# Altium project ek-ra8d2_mp - Customer.PrjPcb (part 4 of 5)

## Sheet USB High Speed.SchDoc
size A3; Company Name: Renesas Electronics America; CompanyURL: www.renesas.com; PageSetup: Record=PageOptions|CenterHorizontal=True|CenterVertical=True|PrintScale=1.00|XCorrection=1.00|YCorrection=1.00|PrintKind=1|BorderSize=5000000|LeftOffset=0|BottomOffset=0|Orientation=2|PaperLength=1000|PaperWidth=1000|Scale=100|PaperSource=7|PrintQuality=-4|MediaType=1|DitherType=10|PaperKind=A5 148x210mm|PrintScaleMode=1; ReleaseDate: 16.09.2025; Version: MP; SPICEModelCache: <root> / <DocumentId>LYYELOHJ</DocumentId> / </root>; SheetNumber: 14; SheetTotal: 18; VariantNumber: 0; DSheetNumber: 1
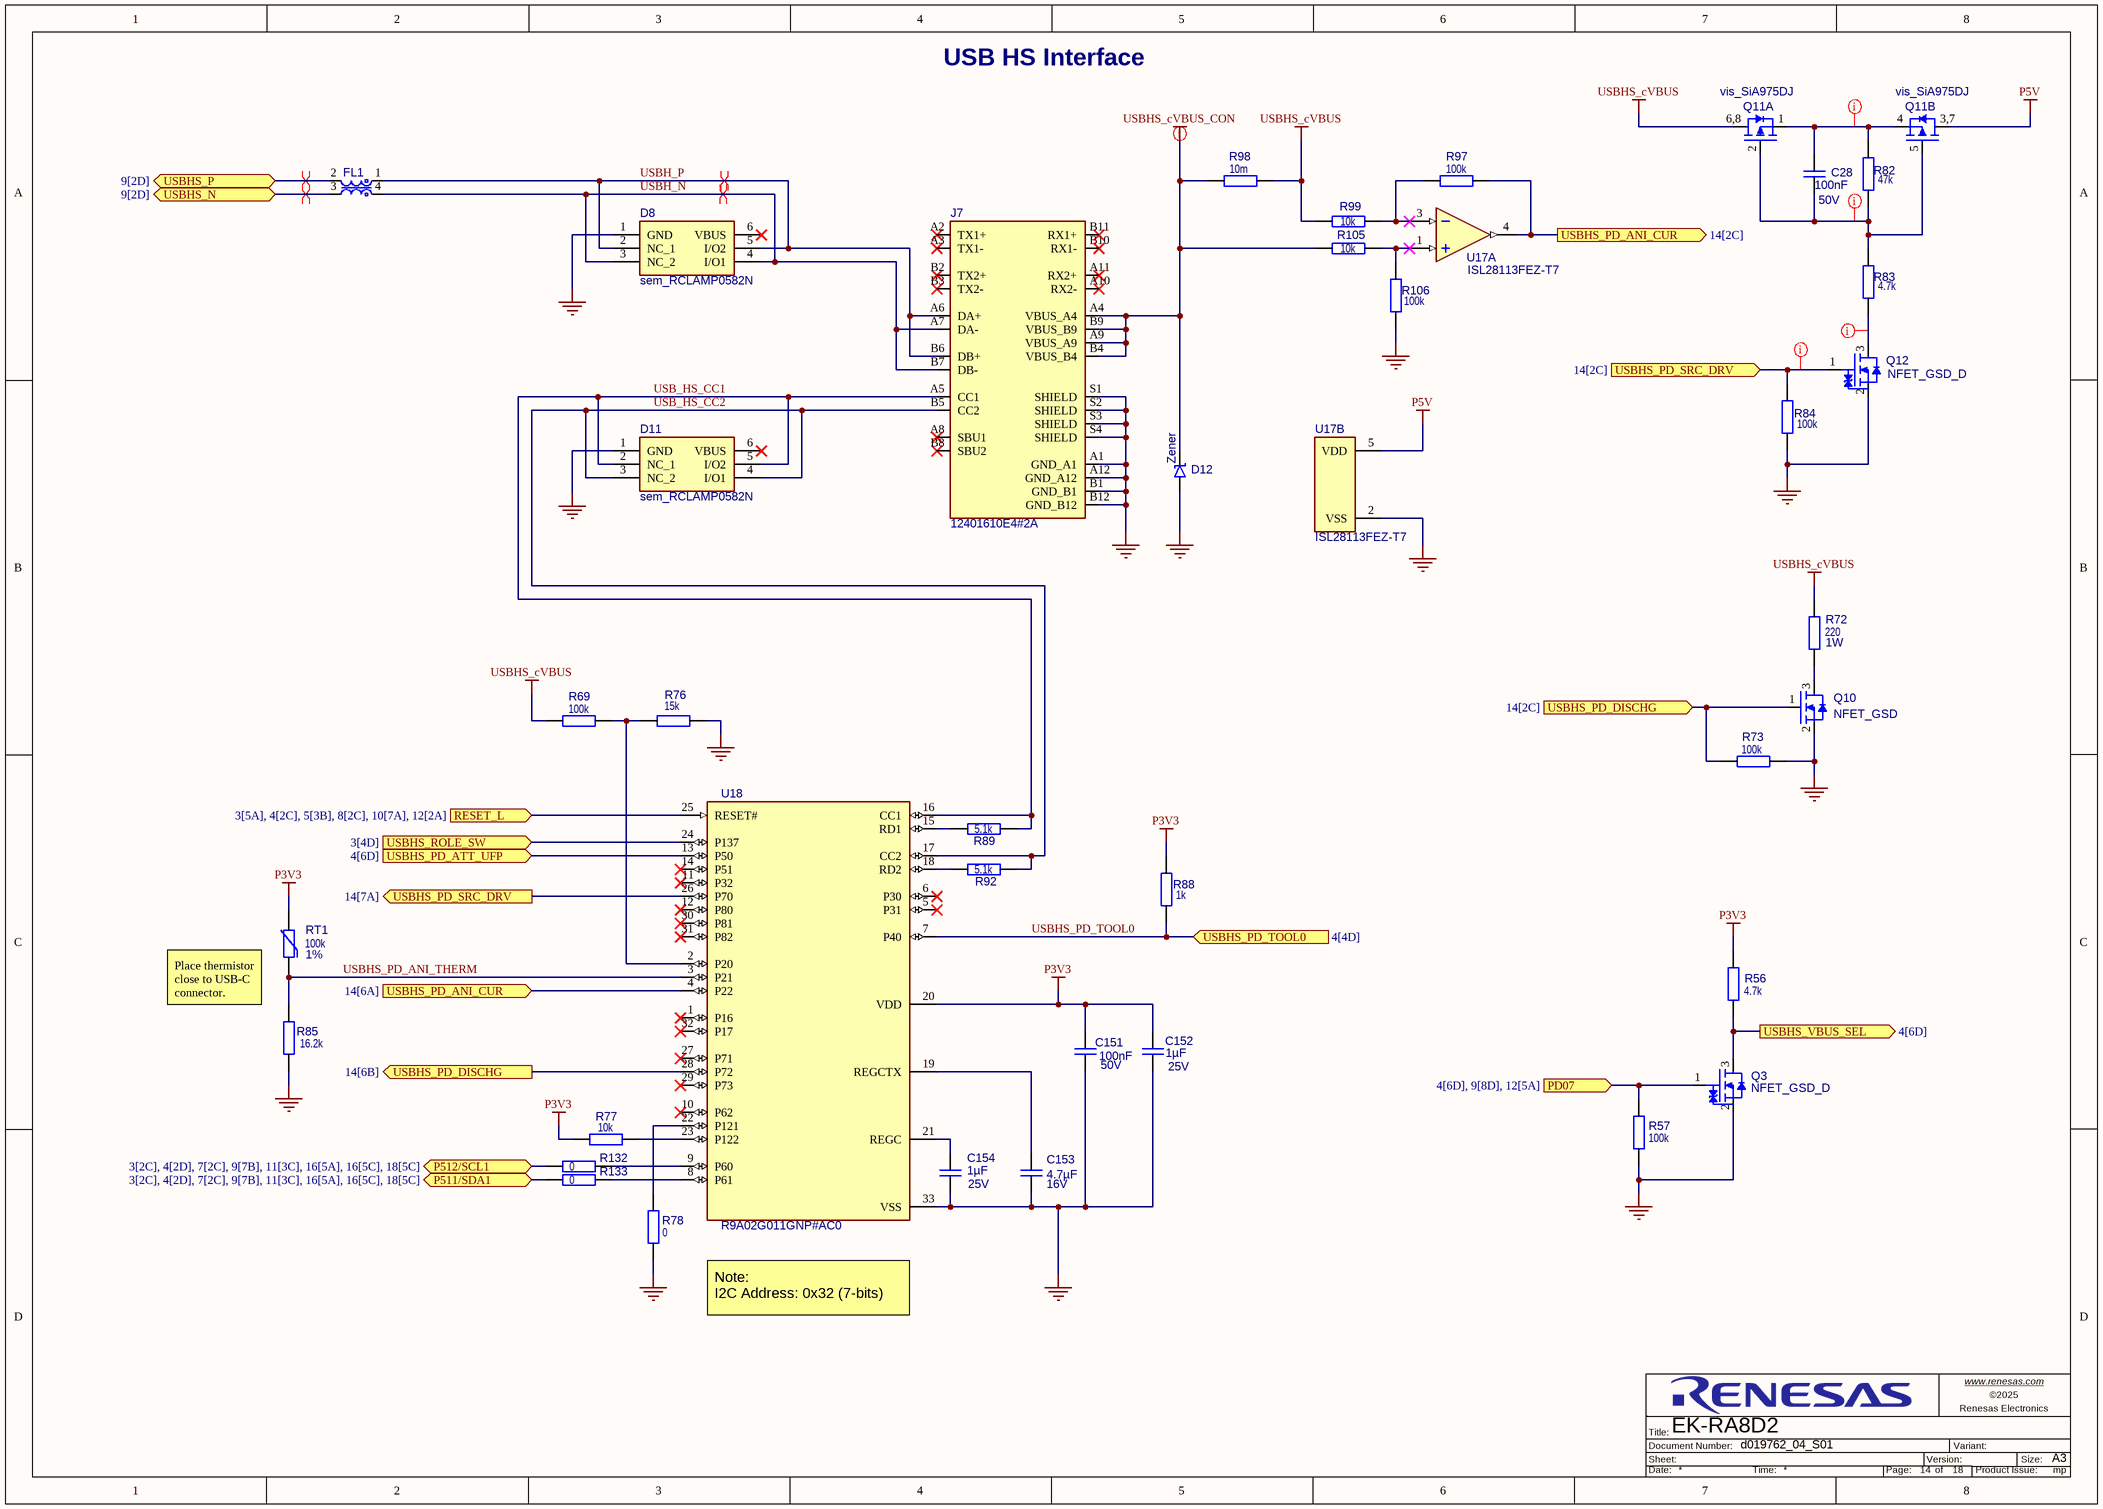
[diagram p13: USB High Speed.SchDoc]

### Parts
C28  value 100nF  Operating Voltage Max: 50V  [C_EIA0402_0p55]  (hidden comment: Capacitor)
C151  value 100nF  Operating Voltage Max: 50V  [C_EIA0402_0p55]  (hidden comment: Capacitor)
C152  value 1µF  Operating Voltage Max: 25V  [C_EIA0402_0p6]  (hidden comment: Capacitor)
C153  value 4.7µF  Operating Voltage Max: 16V  [C_EIA0603_1p0]  (hidden comment: Capacitor)
C154  value 1µF  Operating Voltage Max: 25V  [C_EIA0402_0p6]  (hidden comment: Capacitor)
D8  sem_RCLAMP0582N  [sem_SLP-6_SLP1210N6]
D11  sem_RCLAMP0582N  [sem_SLP-6_SLP1210N6]
D12  Zener  [sem_SGP-2_SGP1610N2]
FL1  CMC_1-2_4-3  [mur_EIA03025]  (value not drawn)
J7  12401610E4#2A  [amp_12401610E42A]
Q3  NFET_GSD_D  [roh_SOT-416FL_SC-89]
Q10  NFET_GSD  [ir_sot-23_3N]
Q11  vis_SiA975DJ  [vis_SC70-6L_Dual]  (parts A,B of 2)
Q12  NFET_GSD_D  [roh_SOT-416FL_SC-89]
R56  value 4.7k  [R_EIA0402]  (hidden comment: Resistor)
R57  value 100k  [R_EIA0402]  (hidden comment: Resistor)
R69  value 100k  [R_EIA0402]  (hidden comment: Resistor)
R72  value 220  Power: 1W  [R_EIA2512]  (hidden comment: Resistor)
R73  value 100k  [R_EIA0402]  (hidden comment: Resistor)
R76  value 15k  [R_EIA0402]  (hidden comment: RC0402FR-0715KL)
R77  value 10k  [R_EIA0402]  (hidden comment: Resistor)
R78  value 0  [R_EIA0402]  (hidden comment: Resistor)
R82  value 47k  [R_EIA0402]  (hidden comment: Resistor)
R83  value 4.7k  [R_EIA0402]  (hidden comment: Resistor)
R84  value 100k  [R_EIA0402]  (hidden comment: Resistor)
R85  value 16.2k  [R_EIA0402]  (hidden comment: Resistor)
R88  value 1k  [R_EIA0402]  (hidden comment: Resistor)
R89  value 5.1k  [R_EIA0402]  (hidden comment: Resistor)
R92  value 5.1k  [R_EIA0402]  (hidden comment: Resistor)
R97  value 100k  [R_EIA0402]  (hidden comment: Resistor)
R98  value 10m  [R_EIA0603]  (hidden comment: Resistor)
R99  value 10k  [R_EIA0402]  (hidden comment: Resistor)
R105  value 10k  [R_EIA0402]  (hidden comment: Resistor)
R106  value 100k  [R_EIA0402]  (hidden comment: Resistor)
R132  value 0  [R_EIA0402]  (hidden comment: Resistor)
R133  value 0  [R_EIA0402]  (hidden comment: Resistor)
RT1  value 100k  Tolerance: 1%  [R_EIA0402]  (hidden comment: Thermistor)
U17  ISL28113FEZ-T7  [ren_SC70-5_P5.049]  (parts A,B of 2)
U18  R9A02G011GNP#AC0  [ren_HVQFN-32_PVQN0032KG-A]

### Ports
P511/SDA1 (bidir, see 3[2C], 4[2D], 7[2C], 9[7B], 11[3C], 16[5A], 16[5C], 18[5C]), P512/SCL1 (bidir, see 3[2C], 4[2D], 7[2C], 9[7B], 11[3C], 16[5A], 16[5C], 18[5C]), PD07 (in, see 4[6D], 9[8D], 12[5A]), RESET_L (in, see 3[5A], 4[2C], 5[3B], 8[2C], 10[7A], 12[2A]), USBHS_N (bidir, see 9[2D]), USBHS_P (bidir, see 9[2D]), USBHS_PD_ANI_CUR (in, see 14[6A]), USBHS_PD_ANI_CUR (out, see 14[2C]), USBHS_PD_ATT_UFP (in, see 4[6D]), USBHS_PD_DISCHG (in, see 14[2C]), USBHS_PD_DISCHG (out, see 14[6B]), USBHS_PD_SRC_DRV (in, see 14[2C]), USBHS_PD_SRC_DRV (out, see 14[7A]), USBHS_PD_TOOL0 (in, see 4[4D]), USBHS_ROLE_SW (in, see 3[4D]), USBHS_VBUS_SEL (out, see 4[6D])

### Nets
GND: C151.2 C152.1 C153.2 C154.1 D8.1(GND) D11.1(GND) D12.2(A) J7.A1(GND_A1) J7.A12(GND_A12) J7.B1(GND_B1) J7.B12(GND_B12) J7.S1(SHIELD) J7.S2(SHIELD) J7.S3(SHIELD) J7.S4(SHIELD) Q3.2(Source) Q10.2(Source) Q12.2(Source) R57.1 R73.2 R76.1 R78.1 R84.1 R85.1 R106.1 U17.2(VSS) U18.33(VSS)
P3V3: C151.1 C152.2 R56.2 R77.2 R88.2 RT1.2 U18.20(VDD)
P5V: Q11.3,7(Drain2) U17.5(VDD)
USBHS_cVBUS: Q11.6,8(Drain1) R69.1 R72.2 R98.2 R99.1
USBHS_cVBUS_CON: D12.1(K) J7.A4(VBUS_A4) J7.A9(VBUS_A9) J7.B4(VBUS_B4) J7.B9(VBUS_B9) R98.1 R105.1
P511/SDA1: R133.2 ; port P511/SDA1
P512/SCL1: R132.2 ; port P512/SCL1
PD07: Q3.1(Gate) R57.2 ; port PD07
RESET_L: U18.25(RESET#) ; port RESET_L
USB_HS_CC1: D11.2(NC_1) D11.5(I/O2) J7.A5(CC1) R89.2 U18.16(CC1)
USB_HS_CC2: D11.3(NC_2) D11.4(I/O1) J7.B5(CC2) R92.2 U18.17(CC2)
USBH_N: D8.3(NC_2) D8.4(I/O1) FL1.4 J7.A7(DA-) J7.B7(DB-)
USBH_P: D8.2(NC_1) D8.5(I/O2) FL1.1 J7.A6(DA+) J7.B6(DB+)
USBHS_N: FL1.3 ; port USBHS_N
USBHS_P: FL1.2 ; port USBHS_P
USBHS_PD_ANI_CUR: R97.2 U17.4(OUT) U18.4(P22) ; port USBHS_PD_ANI_CUR
USBHS_PD_ANI_THERM: R85.2 RT1.1 U18.3(P21)
USBHS_PD_ATT_UFP: U18.13(P50) ; port USBHS_PD_ATT_UFP
USBHS_PD_DISCHG: Q10.1(Gate) R73.1 U18.28(P72) ; port USBHS_PD_DISCHG
USBHS_PD_SRC_DRV: Q12.1(Gate) R84.2 U18.26(P70) ; port USBHS_PD_SRC_DRV
USBHS_PD_TOOL0: R88.1 U18.7(P40) ; port USBHS_PD_TOOL0
USBHS_ROLE_SW: U18.24(P137) ; port USBHS_ROLE_SW
USBHS_VBUS_SEL: Q3.3(Drain) R56.1 ; port USBHS_VBUS_SEL
NetC28_1: C28.1 Q11.2(Gate1) Q11.5(Gate2) R82.1 R83.2
NetC28_2: C28.2 Q11.1(Source1) Q11.4(Source2) R82.2
NetC153_1: C153.1 U18.19(REGCTX)
NetC154_2: C154.2 U18.21(REGC)
NetQ10_3: Q10.3(Drain) R72.1
NetQ12_3: Q12.3(Drain) R83.1
NetR69_2: R69.2 R76.2 U18.2(P20)
NetR77_1: R77.1 U18.23(P122)
NetR78_2: R78.2 U18.22(P121)
NetR89_1: R89.1 U18.15(RD1)
NetR92_1: R92.1 U18.18(RD2)
NetR97_1: R97.1 R99.2 U17.3(IN-)
NetR105_2: R105.2 R106.2 U17.1(IN+)
NetR132_1: R132.1 U18.9(P60)
NetR133_1: R133.1 U18.8(P61)

Not connected (* = marked no-connect by the designer): D8 6(VBUS)*; D11 6(VBUS)*; J7 A2(TX1+)* A3(TX1-)* A8(SBU1)* A10(RX2-)* A11(RX2+)* B2(TX2+)* B3(TX2-)* B8(SBU2)* B10(RX1-)* B11(RX1+)*; U18 1(P16)* 5(P31)* 6(P30)* 10(P62)* 11(P32)* 12(P80)* 14(P51)* 27(P71)* 29(P73)* 30(P81)* 31(P82)* 32(P17)*

### Layout directives
differential pair; differential pair class USB: USBH_N, USBH_P, USBHS_N, USBHS_P
net class Power: NetC28_2
net class Power_Control: NetC28_1, NetQ12_3, USBHS_PD_SRC_DRV
net class Power; rule Supply Nets [Voltage = 5.000]: USBHS_cVBUS_CON

### Notes on the sheet
- USB HS Interface
- Place thermistor close to USB-C connector.
- Note:
  I2C Address: 0x32 (7-bits)
- www.renesas.com <http://www.renesas.com>
- Sheet:
- Title:
- Document Number:
- Version:
- Variant:
- Renesas Electronics
- Size:
- A3
- Date:
- Time:
- Page:
- of
- Product Issue:

### Library data of the parts
C28 C151 = CAP-00003203-9: as C108 on sheet Gigabit Ethernet; Dielectric: X7R; Height: 550µm; Operating Temperature Max: 125°C; Operating Temperature Min: -55°C
C152 C154 = CAP-00000014-5: Capacitor,EIA0402,1u,25V,X6S; Tolerance: 10%; Qualification: AEC-Q200; Subtype: MLCC; Dielectric: X6S; Height: 600µm; Operating Temperature Max: 105°C; Operating Temperature Min: -55°C
C153 = CAP-00003210-8: Capacitor,EIA0603,4.7u,16V,X7S; Tolerance: 10%; Qualification: AEC-Q200; Subtype: MLCC; Dielectric: X7S; Height: 1mm; Operating Temperature Max: 125°C; Operating Temperature Min: -55°C
D8 D11 = DIO-00003463-14: Low Capacitance TVS Diode Array; Qualification: AEC-Q100; Reverse Voltage: 6.5V; Subtype: ESD; Height: 580µm; Operating Temperature Max: 125°C; Operating Temperature Min: -40°C
D12 = DIO-00000001-5: ESD Suppressor Diode TVS Uni-Dir 22V 55Vc Automotive 2-Pin SGP T/R; Qualification: AEC-Q100; Height: 550µm; Operating Temperature Max: 125°C; Operating Temperature Min: -40°C; Reverse Voltage: 22V; Subtype: ESD
FL1 = IND-00000004-4: Common Mode Choke / Filters, 90uH 25%, 0.1A, 3.8Ohm DCR; Current: 100mA; DC Resistance: 3.8; Frequency: 100MHz; Subtype: CMC; Value: 90; Tolerance: 25%; Height: 450mm; Operating Temperature Max: 85°C; Operating Temperature Min: -40°C; Qualification: -
J7 = CON-00000065-5: Connector USB 3.2 Gen2 Type C Horizontal SMD; Gender: female; Current: 5A; Operating Voltage Max: 20V; Pin Count: 24; Operating Temperature Max: 85°C; Qualification: -; Operating Temperature Min: -40°C; Height: 3.43mm
Q3 Q12 = TRA-00000001-2: N-Channel 60V 250mA Small Signal MOSFET; DC Resistance: 2.4; Gate Voltage Threshold Max: 2.3V; Gate Voltage Threshold Min: 1V; Input Capacitance: 15pF; Power: 150mW; Subtype: NMOS; Current: 250mA; Operating Temperature Max: 150°C; Operating Temperature Min: -55°C; Operating Voltage Max: 60V; Pin Count: 3; Qualification: -
Q10 = TRA-00000004-3: N-Channel 30V 5A 1.3W MOSFET; DC Resistance: 29m; Gate Voltage Threshold Max: 1.1V; Gate Voltage Threshold Min: 500mV; Input Capacitance: 650pF; Subtype: NMOS; Current: 5A; Operating Temperature Max: 150°C; Operating Temperature Min: -55°C; Operating Voltage Max: 30V; Pin Count: 3; Power: 1.3W; Qualification: -
Q11 = TRA-00000003-7: Dual P-Channel -12V -4.5A MOSFET; DC Resistance: 0.11; Gate Voltage Threshold Max: -1V; Gate Voltage Threshold Min: -400mV; Input Capacitance: 1.5nF; Power: 1.9W; Subtype: PMOS; Current: -4.5A; Operating Temperature Max: 150°C; Operating Temperature Min: -55°C; Operating Voltage Max: -12V; Pin Count: 6; Qualification: -
R56 R83 = RES-00000894-9: Resistor,EIA0402,4.7k,0.0625W; Power: 62.5mW; Tolerance: 1%; Subtype: Chip Resistor; Operating Temperature Max: 155°C; Operating Temperature Min: -55°C; Qualification: -
R57 R69 R73 R84 R97 R106 = RES-00000926-9: Resistor,EIA0402,100k,0.0625W; Power: 62.5mW; Tolerance: 1%; Subtype: Chip Resistor; Operating Temperature Max: 155°C; Operating Temperature Min: -55°C; Qualification: -
R72 = RES-00003204-2: Resistor,EIA2512,220,1W; Tolerance: 1%; Operating Voltage Max: 200V; Qualification: AEC-Q100; Subtype: Chip Resistor; Height: 750µm; Operating Temperature Max: 155°C; Operating Temperature Min: -55°C; Temperature Coefficient: -
R76 = RES-00000906-9: Resistor,EIA0402,15k,0.0625W; Tolerance: 1%; Power: 62.5mW; Subtype: Chip Resistor; Operating Temperature Min: -55°C; Qualification: -; Operating Temperature Max: 155°C
R77 R99 R105 = RES-00000902-9: Resistor,EIA0402,10k,0.0625W; Power: 62.5mW; Tolerance: 1%; Subtype: Chip Resistor; Operating Temperature Max: 155°C; Operating Temperature Min: -55°C; Qualification: -
R78 R132 R133 = RES-00000801-9: Resistor,EIA0402,0,0.0625W; Power: 62.5mW; Tolerance: 5%; Subtype: Chip Resistor; Operating Temperature Max: 155°C; Operating Temperature Min: -55°C; Qualification: -
R82 = RES-00000918-9: Resistor,EIA0402,47k,0.0625W; Power: 62.5mW; Tolerance: 1%; Subtype: Chip Resistor; Operating Temperature Max: 155°C; Operating Temperature Min: -55°C; Qualification: -
R85 = RES-00001689-10: Resistor,EIA0402,16.2k,0.0625W; Power: 62.5mW; Tolerance: 1%; Subtype: Chip Resistor; Operating Temperature Max: 155°C; Operating Temperature Min: -55°C; Qualification: -
R88 = RES-00000878-9: Resistor,EIA0402,1k,0.0625W; Power: 62.5mW; Tolerance: 1%; Subtype: Chip Resistor; Operating Temperature Max: 155°C; Operating Temperature Min: -55°C; Qualification: -
R89 R92 = RES-00000895-9: Resistor,EIA0402,5.1k,0.0625W; Power: 62.5mW; Tolerance: 1%; Subtype: Chip Resistor; Operating Temperature Max: 155°C; Operating Temperature Min: -55°C; Qualification: -
R98 = RES-00003205-3: Resistor,EIA0603,10m,0.25W; Power: 250mW; Tolerance: 1%; Qualification: AEC-Q200; Subtype: Chip Resistor; Height: 700µm; Operating Temperature Max: 125°C; Operating Temperature Min: -55°C
RT1 = RES-00000000-6: NTC Thermistor, R_EIA0402, 100K, 4250K; Operating Voltage Max: 5V; Power: 160µW; Height: 550µm; Operating Temperature Max: 125°C; Operating Temperature Min: -40°C; Qualification: -; Subtype: Thermistor
U17 = ICS-00000015-3: Single, General Purpose Micropower, RRIO Operational Amplifier; Frequency: 2MHz; Operating Voltage Max: 5.5V; Operating Voltage Min: 1.8V; Subtype: Power; Operating Temperature Max: 125°C; Operating Temperature Min: -40°C; Output Voltage Max: 5.5V; Pin Count: 5; Qualification: -
U18 = ICS-00000018-7: USB Power Delivery Controller, USB 3.1, HVQFN32; Frequency: 24MHz; Operating Voltage Max: 5.5V; Operating Voltage Min: 3V; Output Voltage Min: 0V; Subtype: Digital; Operating Temperature Max: 105°C; Operating Temperature Min: -40°C; Output Voltage Max: 5.5V; Pin Count: 33; Qualification: -

## Sheet Octal SPI Flash.SchDoc
size A3; Company Name: Renesas Electronics America; CompanyURL: www.renesas.com; PageSetup: Record=PageOptions|CenterHorizontal=True|CenterVertical=True|PrintScale=1.00|XCorrection=1.00|YCorrection=1.00|PrintKind=1|BorderSize=5000000|LeftOffset=0|BottomOffset=0|Orientation=2|PaperLength=1000|PaperWidth=1000|Scale=100|PaperSource=7|PrintQuality=-4|MediaType=1|DitherType=10|PaperKind=A5 148x210mm|PrintScaleMode=1; ReleaseDate: 16.09.2025; Version: MP; SheetNumber: 15; SheetTotal: 18; VariantNumber: 0; DSheetNumber: 1
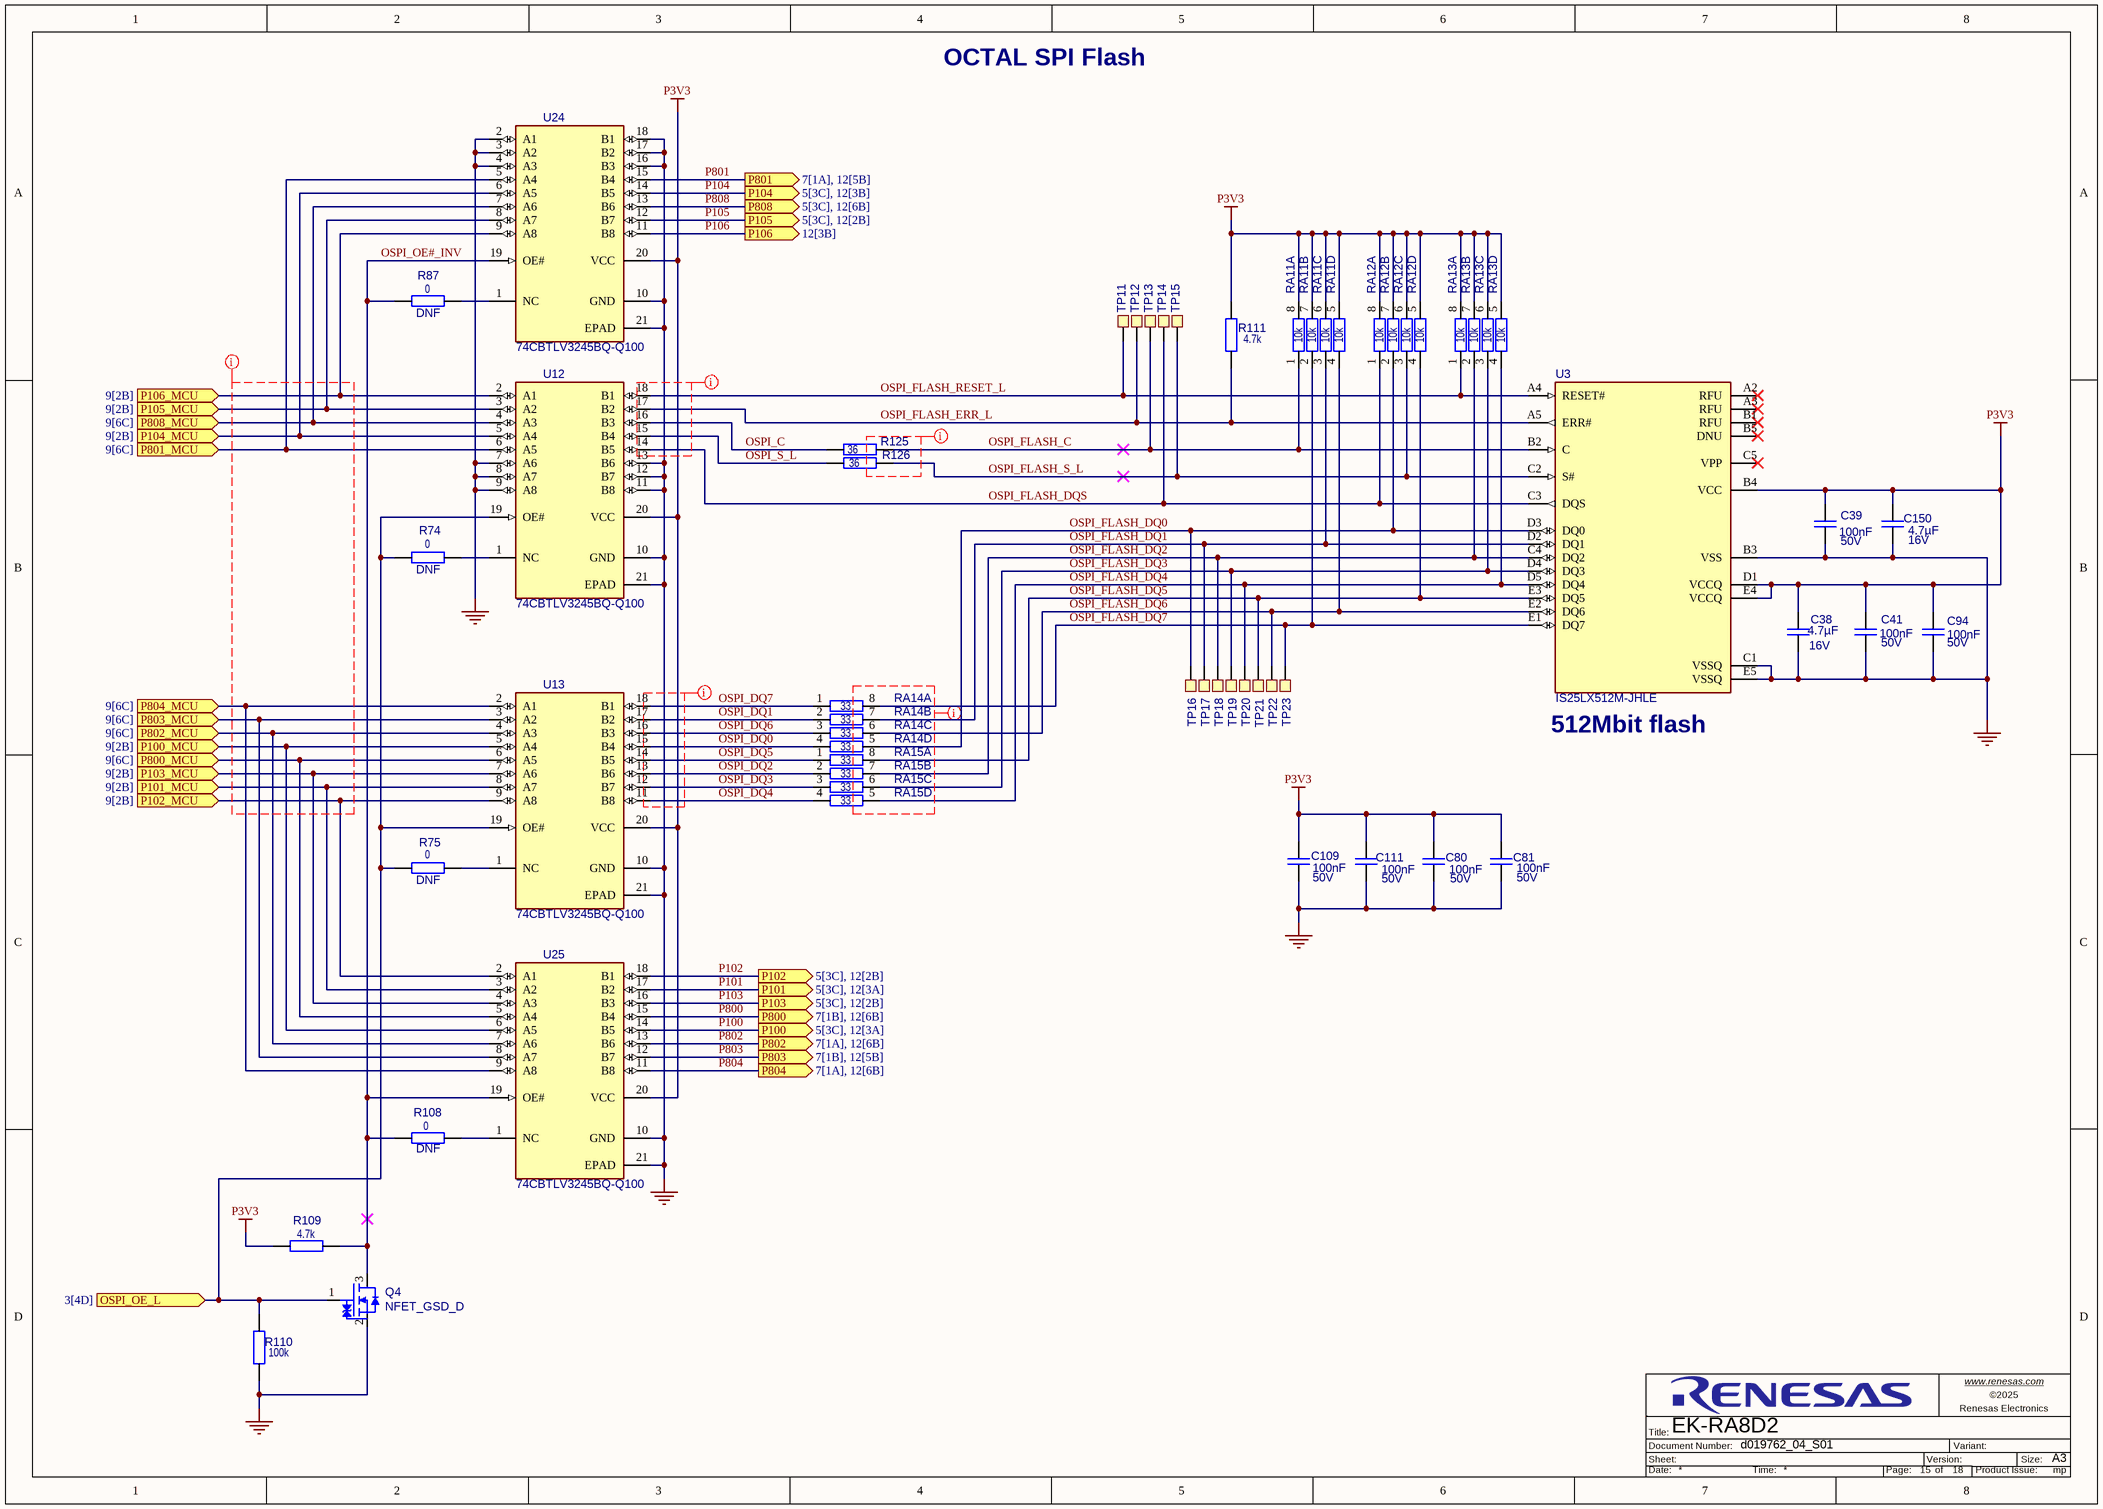
[diagram p14: Octal SPI Flash.SchDoc]

### Parts
C38  value 4.7µF  Operating Voltage Max: 16V  [C_EIA0402_0p7]  (hidden comment: KGM05CR51C475MH)
C39  value 100nF  Operating Voltage Max: 50V  [C_EIA0402_0p55]  (hidden comment: Capacitor)
C41  value 100nF  Operating Voltage Max: 50V  [C_EIA0402_0p55]  (hidden comment: Capacitor)
C80  value 100nF  Operating Voltage Max: 50V  [C_EIA0402_0p55]  (hidden comment: Capacitor)
C81  value 100nF  Operating Voltage Max: 50V  [C_EIA0402_0p55]  (hidden comment: Capacitor)
C94  value 100nF  Operating Voltage Max: 50V  [C_EIA0402_0p55]  (hidden comment: Capacitor)
C109  value 100nF  Operating Voltage Max: 50V  [C_EIA0402_0p55]  (hidden comment: Capacitor)
C111  value 100nF  Operating Voltage Max: 50V  [C_EIA0402_0p55]  (hidden comment: Capacitor)
C150  value 4.7µF  Operating Voltage Max: 16V  [C_EIA0402_0p7]  (hidden comment: KGM05CR51C475MH)
Q4  NFET_GSD_D  [roh_SOT-416FL_SC-89]
R74  value 0  [R_EIA0402]  (hidden comment: Resistor)
R75  value 0  [R_EIA0402]  (hidden comment: Resistor)
R87  value 0  [R_EIA0402]  (hidden comment: Resistor)
R108  value 0  [R_EIA0402]  (hidden comment: Resistor)
R109  value 4.7k  [R_EIA0402]  (hidden comment: Resistor)
R110  value 100k  [R_EIA0402]  (hidden comment: Resistor)
R111  value 4.7k  [R_EIA0402]  (hidden comment: Resistor)
R125  value 36  [R_EIA0402]  (hidden comment: Resistor)
R126  value 36  [R_EIA0402]  (hidden comment: Resistor)
RA11  value 10k  [R_Array_EIA0804]  (hidden comment: Resistor_Array)  (parts A,B,C,D of 4)
RA12  value 10k  [R_Array_EIA0804]  (hidden comment: Resistor_Array)  (parts A,B,C,D of 4)
RA13  value 10k  [R_Array_EIA0804]  (hidden comment: Resistor_Array)  (parts A,B,C,D of 4)
RA14  value 33  [R_Array_EIA0804]  (hidden comment: Resistor_Array)  (parts A,B,C,D of 4)
RA15  value 33  [R_Array_EIA0804]  (hidden comment: Resistor_Array)  (parts A,B,C,D of 4)
TP11  TP_VIA_0p45_0p15  [TP_VIA_0p45_0p15]  (value not drawn)  (no BOM)
TP12  TP_VIA_0p45_0p15  [TP_VIA_0p45_0p15]  (value not drawn)  (no BOM)
TP13  TP_VIA_0p45_0p15  [TP_VIA_0p45_0p15]  (value not drawn)  (no BOM)
TP14  TP_VIA_0p45_0p15  [TP_VIA_0p45_0p15]  (value not drawn)  (no BOM)
TP15  TP_VIA_0p45_0p15  [TP_VIA_0p45_0p15]  (value not drawn)  (no BOM)
TP16  TP_VIA_0p45_0p15  [TP_VIA_0p45_0p15]  (value not drawn)  (no BOM)
TP17  TP_VIA_0p45_0p15  [TP_VIA_0p45_0p15]  (value not drawn)  (no BOM)
TP18  TP_VIA_0p45_0p15  [TP_VIA_0p45_0p15]  (value not drawn)  (no BOM)
TP19  TP_VIA_0p45_0p15  [TP_VIA_0p45_0p15]  (value not drawn)  (no BOM)
TP20  TP_VIA_0p45_0p15  [TP_VIA_0p45_0p15]  (value not drawn)  (no BOM)
TP21  TP_VIA_0p45_0p15  [TP_VIA_0p45_0p15]  (value not drawn)  (no BOM)
TP22  TP_VIA_0p45_0p15  [TP_VIA_0p45_0p15]  (value not drawn)  (no BOM)
TP23  TP_VIA_0p45_0p15  [TP_VIA_0p45_0p15]  (value not drawn)  (no BOM)
U3  IS25LX512M-JHLE  [isi_TFBGA-24_8x6]
U12  74CBTLV3245BQ-Q100  [nex_SOT-764-1_DHVQFN20]
U13  74CBTLV3245BQ-Q100  [nex_SOT-764-1_DHVQFN20]
U24  74CBTLV3245BQ-Q100  [nex_SOT-764-1_DHVQFN20]
U25  74CBTLV3245BQ-Q100  [nex_SOT-764-1_DHVQFN20]

### Ports
OSPI_OE_L (in, see 3[4D]), P100 (out, see 5[3C], 12[3A]), P100_MCU (in, see 9[2B]), P101 (out, see 5[3C], 12[3A]), P101_MCU (in, see 9[2B]), P102 (out, see 5[3C], 12[2B]), P102_MCU (in, see 9[2B]), P103 (out, see 5[3C], 12[2B]), P103_MCU (in, see 9[2B]), P104 (out, see 5[3C], 12[3B]), P104_MCU (in, see 9[2B]), P105 (out, see 5[3C], 12[2B]), P105_MCU (in, see 9[2B]), P106 (out, see 12[3B]), P106_MCU (in, see 9[2B]), P800 (out, see 7[1B], 12[6B]), P800_MCU (in, see 9[6C]), P801 (out, see 7[1A], 12[5B]), P801_MCU (in, see 9[6C]), P802 (out, see 7[1A], 12[6B]), P802_MCU (in, see 9[6C]), P803 (out, see 7[1B], 12[5B]), P803_MCU (in, see 9[6C]), P804 (out, see 7[1A], 12[6B]), P804_MCU (in, see 9[6C]), P808 (out, see 5[3C], 12[6B]), P808_MCU (in, see 9[6C])

### Nets
GND: C38.2 C39.2 C41.2 C80.2 C81.2 C94.2 C109.2 C111.2 C150.2 Q4.2(Source) R110.1 U3.B3(VSS) U3.C1(VSSQ) U3.E5(VSSQ) U12.7(A6) U12.8(A7) U12.9(A8) U12.10(GND) U12.11(B8) U12.12(B7) U12.13(B6) U12.21(EPAD) U13.10(GND) U13.21(EPAD) U24.2(A1) U24.3(A2) U24.4(A3) U24.10(GND) U24.16(B3) U24.17(B2) U24.18(B1) U24.21(EPAD) U25.10(GND) U25.21(EPAD)
P3V3: C38.1 C39.1 C41.1 C80.1 C81.1 C94.1 C109.1 C111.1 C150.1 R109.1 R111.2 RA11.5 RA11.6 RA11.7 RA11.8 RA12.5 RA12.6 RA12.7 RA12.8 RA13.5 RA13.6 RA13.7 RA13.8 U3.B4(VCC) U3.D1(VCCQ) U3.E4(VCCQ) U12.20(VCC) U13.20(VCC) U24.20(VCC) U25.20(VCC)
OSPI_C: R125.1 U12.16(B3)
OSPI_DQ0: RA14.4 U13.15(B4)
OSPI_DQ1: RA14.2 U13.17(B2)
OSPI_DQ2: RA15.2 U13.13(B6)
OSPI_DQ3: RA15.3 U13.12(B7)
OSPI_DQ4: RA15.4 U13.11(B8)
OSPI_DQ5: RA15.1 U13.14(B5)
OSPI_DQ6: RA14.3 U13.16(B3)
OSPI_DQ7: RA14.1 U13.18(B1)
OSPI_FLASH_C: R125.2 RA11.1 TP13.1 U3.B2(C)
OSPI_FLASH_DQ0: RA12.2 RA14.5 TP16.1 U3.D3(DQ0)
OSPI_FLASH_DQ1: RA11.3 RA14.7 TP17.1 U3.D2(DQ1)
OSPI_FLASH_DQ2: RA13.2 RA15.7 TP18.1 U3.C4(DQ2)
OSPI_FLASH_DQ3: RA13.3 RA15.6 TP19.1 U3.D4(DQ3)
OSPI_FLASH_DQ4: RA13.4 RA15.5 TP20.1 U3.D5(DQ4)
OSPI_FLASH_DQ5: RA12.4 RA15.8 TP21.1 U3.E3(DQ5)
OSPI_FLASH_DQ6: RA11.4 RA14.6 TP22.1 U3.E2(DQ6)
OSPI_FLASH_DQ7: RA11.2 RA14.8 TP23.1 U3.E1(DQ7)
OSPI_FLASH_DQS: RA12.1 TP14.1 U3.C3(DQS) U12.14(B5)
OSPI_FLASH_ERR_L: R111.1 TP12.1 U3.A5(ERR#) U12.17(B2)
OSPI_FLASH_RESET_L: RA13.1 TP11.1 U3.A4(RESET#) U12.18(B1)
OSPI_FLASH_S_L: R126.2 RA12.3 TP15.1 U3.C2(S#)
OSPI_OE#_INV: Q4.3(Drain) R87.1 R108.1 R109.2 U24.19(OE#) U25.19(OE#)
OSPI_OE_L: Q4.1(Gate) R74.1 R75.1 R110.2 U12.19(OE#) U13.19(OE#) ; port OSPI_OE_L
OSPI_S_L: R126.1 U12.15(B4)
P100: U25.14(B5) ; port P100
P100_MCU: U13.5(A4) U25.6(A5) ; port P100_MCU
P101: U25.17(B2) ; port P101
P101_MCU: U13.8(A7) U25.3(A2) ; port P101_MCU
P102: U25.18(B1) ; port P102
P102_MCU: U13.9(A8) U25.2(A1) ; port P102_MCU
P103: U25.16(B3) ; port P103
P103_MCU: U13.7(A6) U25.4(A3) ; port P103_MCU
P104: U24.14(B5) ; port P104
P104_MCU: U12.5(A4) U24.6(A5) ; port P104_MCU
P105: U24.12(B7) ; port P105
P105_MCU: U12.3(A2) U24.8(A7) ; port P105_MCU
P106: U24.11(B8) ; port P106
P106_MCU: U12.2(A1) U24.9(A8) ; port P106_MCU
P800: U25.15(B4) ; port P800
P800_MCU: U13.6(A5) U25.5(A4) ; port P800_MCU
P801: U24.15(B4) ; port P801
P801_MCU: U12.6(A5) U24.5(A4) ; port P801_MCU
P802: U25.13(B6) ; port P802
P802_MCU: U13.4(A3) U25.7(A6) ; port P802_MCU
P803: U25.12(B7) ; port P803
P803_MCU: U13.3(A2) U25.8(A7) ; port P803_MCU
P804: U25.11(B8) ; port P804
P804_MCU: U13.2(A1) U25.9(A8) ; port P804_MCU
P808: U24.13(B6) ; port P808
P808_MCU: U12.4(A3) U24.7(A6) ; port P808_MCU
NetR74_2: R74.2 U12.1(NC)
NetR75_2: R75.2 U13.1(NC)
NetR87_2: R87.2 U24.1(NC)
NetR108_2: R108.2 U25.1(NC)

Not connected (* = marked no-connect by the designer): U3 A2(RFU)* A3(RFU)* B1(RFU)* B5(DNU)* C5(VPP)*

### Layout directives
net class OSPI_MCU: (no net found under the mark)
net class OSPI: (no net found under the mark)

### Notes on the sheet
- OCTAL SPI Flash
- (near U3) 512Mbit flash
- www.renesas.com <http://www.renesas.com>
- Sheet:
- Title:
- Document Number:
- Version:
- Variant:
- Renesas Electronics
- Size:
- A3
- Date:
- Time:
- Page:
- of
- Product Issue:

### Library data of the parts
C38 C150 = CAP-00000022-3: Capacitor, EIA0402, 4.7u, 16V, X5R; Tolerance: 20%; Subtype: MLCC; Height: 700µm; Dielectric: X5R; Operating Temperature Min: -55°C; Qualification: -; Operating Temperature Max: 85°C
C39 C41 C80 C81 C94 C109 C111 = CAP-00003203-9: as C108 on sheet Gigabit Ethernet; Dielectric: X7R; Height: 550µm; Operating Temperature Max: 125°C; Operating Temperature Min: -55°C
Q4 = TRA-00000001-2: as Q3 on sheet USB High Speed; Current: 250mA; Operating Temperature Max: 150°C; Operating Temperature Min: -55°C; Operating Voltage Max: 60V; Pin Count: 3; Qualification: -
R74 R75 R87 R108 = RES-00000801-9: as R78 on sheet USB High Speed; Operating Temperature Max: 155°C; Operating Temperature Min: -55°C; Qualification: -; DNF: DNF
R109 R111 = RES-00000894-9: as R56 on sheet USB High Speed; Operating Temperature Max: 155°C; Operating Temperature Min: -55°C; Qualification: -
R110 = RES-00000926-9: as R57 on sheet USB High Speed; Operating Temperature Max: 155°C; Operating Temperature Min: -55°C; Qualification: -
R125 R126 = RES-00000843-9: Resistor,EIA0402,36,0.0625W; Power: 62.5mW; Tolerance: 1%; Subtype: Chip Resistor; Operating Temperature Max: 155°C; Operating Temperature Min: -55°C; Qualification: -
  R125: Parameter 1: *
RA11-RA13 = RES-00003206-7: Resistor Network & Array,0804, 10k,0.0625W; Power: 62.5mW; Tolerance: 1%; Qualification: AEC-Q200; Subtype: Resistor Array; Operating Temperature Max: 155°C; Operating Temperature Min: -55°C
RA14 RA15 = RES-00003457-16: Resistor Network & Array,0804,33,0.0625W; Power: 62.5mW; Tolerance: 1%; Qualification: AEC-Q200; Subtype: Resistor Array; Temperature Coefficient: 200ppm; Operating Temperature Max: 155°C; Operating Temperature Min: -55°C
TP11-TP23 = MIS-00003461-11: Testpoint,THT,0.45mm PTH; Value: TP; Subtype: Testpoint; Qualification: -; Pin Count: 1
U3 = ICS-00000135-4: NOR Flash 512Mb, Octal Flash, 3V, 24-ball TFBGA; Operating Voltage Max: 3.6V; Subtype: Digital; Operating Voltage Min: 2.7V; Current: 13mA; Frequency: 133MHz; Pin Count: 24; Operating Temperature Min: -40°C; Qualification: -; Operating Temperature Max: 105°C
U12 U13 U24 U25 = ICS-00000017-5: Octal FET Bus Switch, 5 ohm, 0.3ns max delay, DHVQFN20; Current: 128mA; Operating Voltage Max: 3.6V; Operating Voltage Min: 2.3V; Output Voltage Min: 0V; Qualification: AEC-Q100; Operating Temperature Max: 125°C; Operating Temperature Min: -40°C; Output Voltage Max: 3.6V; Pin Count: 21; Subtype: Bus Switch

## Sheet MIPI Interface and Parallel Display Interface.SchDoc
size A3; Company Name: Renesas Electronics America; CompanyURL: www.renesas.com; PageSetup: Record=PageOptions|CenterHorizontal=True|CenterVertical=True|PrintScale=1.00|XCorrection=1.00|YCorrection=1.00|PrintKind=1|BorderSize=5000000|LeftOffset=0|BottomOffset=0|Orientation=2|PaperLength=1000|PaperWidth=1000|Scale=100|PaperSource=7|PrintQuality=-4|MediaType=1|DitherType=10|PaperKind=A5 148x210mm|PrintScaleMode=1; ReleaseDate: 16.09.2025; Version: MP; SheetNumber: 16; SheetTotal: 18; VariantNumber: 0; DSheetNumber: 1
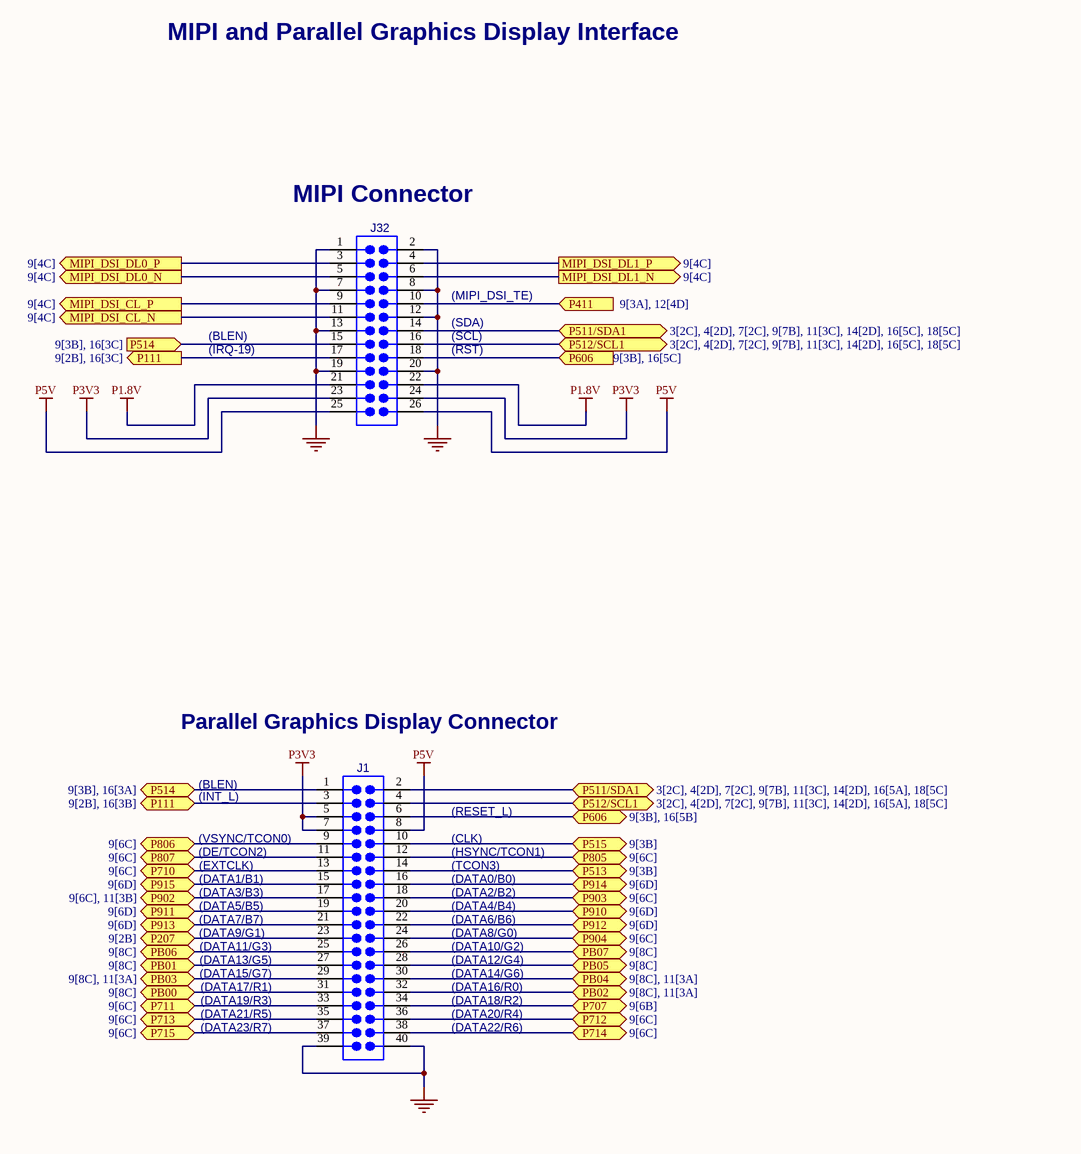
[diagram p15: MIPI Interface and Parallel Display Interface.SchDoc]

### Parts
J1  95157-240LF  [amp_95157-240LF]  (value not drawn)
J32  CON_026  [sam_ERF8-013-05.0-L-DV-TR]  (value not drawn)

### Ports
MIPI_DSI_CL_N (out, see 9[4C]), MIPI_DSI_CL_P (out, see 9[4C]), MIPI_DSI_DL0_N (out, see 9[4C]), MIPI_DSI_DL0_P (out, see 9[4C]), MIPI_DSI_DL1_N (out, see 9[4C]), MIPI_DSI_DL1_P (out, see 9[4C]), P111 (bidir, see 9[2B], 16[3B]), P111 (out, see 9[2B], 16[3C]), P207 (bidir, see 9[2B]), P411 (in, see 9[3A], 12[4D]), P511/SDA1 (bidir, see 3[2C], 4[2D], 7[2C], 9[7B], 11[3C], 14[2D], 16[5A], 18[5C]), P511/SDA1 (bidir, see 3[2C], 4[2D], 7[2C], 9[7B], 11[3C], 14[2D], 16[5C], 18[5C]), P512/SCL1 (bidir, see 3[2C], 4[2D], 7[2C], 9[7B], 11[3C], 14[2D], 16[5A], 18[5C]), P512/SCL1 (bidir, see 3[2C], 4[2D], 7[2C], 9[7B], 11[3C], 14[2D], 16[5C], 18[5C]), P513 (bidir, see 9[3B]), P514 (bidir, see 9[3B], 16[3A]), P514 (in, see 9[3B], 16[3C]), P515 (bidir, see 9[3B]), P606 (bidir, see 9[3B], 16[5B]), P606 (in, see 9[3B], 16[5C]), P707 (bidir, see 9[6B]), P710 (bidir, see 9[6C]), P711 (bidir, see 9[6C]), P712 (bidir, see 9[6C]), P713 (bidir, see 9[6C]), P714 (bidir, see 9[6C]), P715 (bidir, see 9[6C]), P805 (bidir, see 9[6C]), P806 (bidir, see 9[6C]), P807 (bidir, see 9[6C]), P902 (bidir, see 9[6C], 11[3B]), P903 (bidir, see 9[6C]), P904 (bidir, see 9[6C]), P910 (bidir, see 9[6D]), P911 (bidir, see 9[6D]), P912 (bidir, see 9[6D]), P913 (bidir, see 9[6D]), P914 (bidir, see 9[6D]), P915 (bidir, see 9[6D]), PB00 (bidir, see 9[8C]), PB01 (bidir, see 9[8C]), PB02 (bidir, see 9[8C], 11[3A]), PB03 (bidir, see 9[8C], 11[3A]), PB04 (bidir, see 9[8C], 11[3A]), PB05 (bidir, see 9[8C]), PB06 (bidir, see 9[8C]), PB07 (bidir, see 9[8C])

### Nets
GND: J1.39 J1.40 J32.1 J32.2 J32.7 J32.8 J32.12 J32.13 J32.19 J32.20
P1.8V: J32.21 J32.22
P3V3: J1.5 J1.7 J32.23 J32.24
P5V: J1.8 J32.25 J32.26
MIPI_DSI_CL_N: J32.11 ; port MIPI_DSI_CL_N
MIPI_DSI_CL_P: J32.9 ; port MIPI_DSI_CL_P
MIPI_DSI_DL0_N: J32.5 ; port MIPI_DSI_DL0_N
MIPI_DSI_DL0_P: J32.3 ; port MIPI_DSI_DL0_P
MIPI_DSI_DL1_N: J32.6 ; port MIPI_DSI_DL1_N
MIPI_DSI_DL1_P: J32.4 ; port MIPI_DSI_DL1_P
P111: J1.3 J32.17 ; port P111
P207: J1.23 ; port P207
P411: J32.10 ; port P411
P511/SDA1: J1.2 J32.14 ; port P511/SDA1
P512/SCL1: J1.4 J32.16 ; port P512/SCL1
P513: J1.14 ; port P513
P514: J1.1 J32.15 ; port P514
P515: J1.10 ; port P515
P606: J1.6 J32.18 ; port P606
P707: J1.34 ; port P707
P710: J1.13 ; port P710
P711: J1.33 ; port P711
P712: J1.36 ; port P712
P713: J1.35 ; port P713
P714: J1.38 ; port P714
P715: J1.37 ; port P715
P805: J1.12 ; port P805
P806: J1.9 ; port P806
P807: J1.11 ; port P807
P902: J1.17 ; port P902
P903: J1.18 ; port P903
P904: J1.24 ; port P904
P910: J1.20 ; port P910
P911: J1.19 ; port P911
P912: J1.22 ; port P912
P913: J1.21 ; port P913
P914: J1.16 ; port P914
P915: J1.15 ; port P915
PB00: J1.31 ; port PB00
PB01: J1.27 ; port PB01
PB02: J1.32 ; port PB02
PB03: J1.29 ; port PB03
PB04: J1.30 ; port PB04
PB05: J1.28 ; port PB05
PB06: J1.25 ; port PB06
PB07: J1.26 ; port PB07

### Notes on the sheet
- MIPI and Parallel Graphics Display Interface
- (near J32) MIPI Connector
- (BLEN)
- (IRQ-19)
- (SDA)
- (SCL)
- (RST)
- (MIPI_DSI_TE)
- Parallel Graphics Display Connector
- (INT_L)
- (RESET_L)
- (EXTCLK)
- (DATA1/B1)
- (DATA3/B3)
- (DE/TCON2)
- (near J1) (VSYNC/TCON0)
- (HSYNC/TCON1)
- (CLK)
- (DATA0/B0)
- (DATA2/B2)
- (TCON3)
- (DATA5/B5)
- (DATA7/B7)
- (DATA9/G1)
- (DATA13/G5)
- (DATA11/G3)
- (DATA4/B4)
- (DATA10/G2)
- (DATA12/G4)
- (DATA6/B6)
- (DATA8/G0)
- (DATA15/G7)
- (DATA21/R5)
- (DATA23/R7)
- (DATA17/R1)
- (DATA19/R3)
- (DATA20/R4)
- (DATA16/R0)
- (DATA14/G6)
- (DATA18/R2)
- (DATA22/R6)
- www.renesas.com <http://www.renesas.com>
- Sheet:
- Title:
- Document Number:
- Version:
- Variant:
- Renesas Electronics
- Size:
- A3
- Date:
- Time:
- Page:
- of
- Product Issue:

### Library data of the parts
J1 = CON-00000093-4: Header,40way,2row,vertical,2.54mm,SMT; Current: 3A; Gender: male; Height: 9.98mm; Operating Temperature Max: 125°C; Operating Temperature Min: -65°C; Pin Count: 40; Qualification: -
J32 = CON-00003434-15: Edge Rate Rugged High Speed Socket/Terminal Strip; Gender: female; Current: 1.4A; DC Resistance: 15m; Operating Voltage Max: 225V; Height: 5.1mm; Operating Temperature Max: 125°C; Operating Temperature Min: -55°C; Pin Count: 26; Qualification: -

## Sheet SDRAM.SchDoc
size A3; Company Name: Renesas Electronics America; CompanyURL: www.renesas.com; PageSetup: Record=PageOptions|CenterHorizontal=True|CenterVertical=True|PrintScale=1.00|XCorrection=1.00|YCorrection=1.00|PrintKind=1|BorderSize=5000000|LeftOffset=0|BottomOffset=0|Orientation=2|PaperLength=1000|PaperWidth=1000|Scale=100|PaperSource=7|PrintQuality=-4|MediaType=1|DitherType=10|PaperKind=A5 148x210mm|PrintScaleMode=1; ReleaseDate: 16.09.2025; Version: MP; SheetNumber: 17; SheetTotal: 18; VariantNumber: 0; DSheetNumber: 1
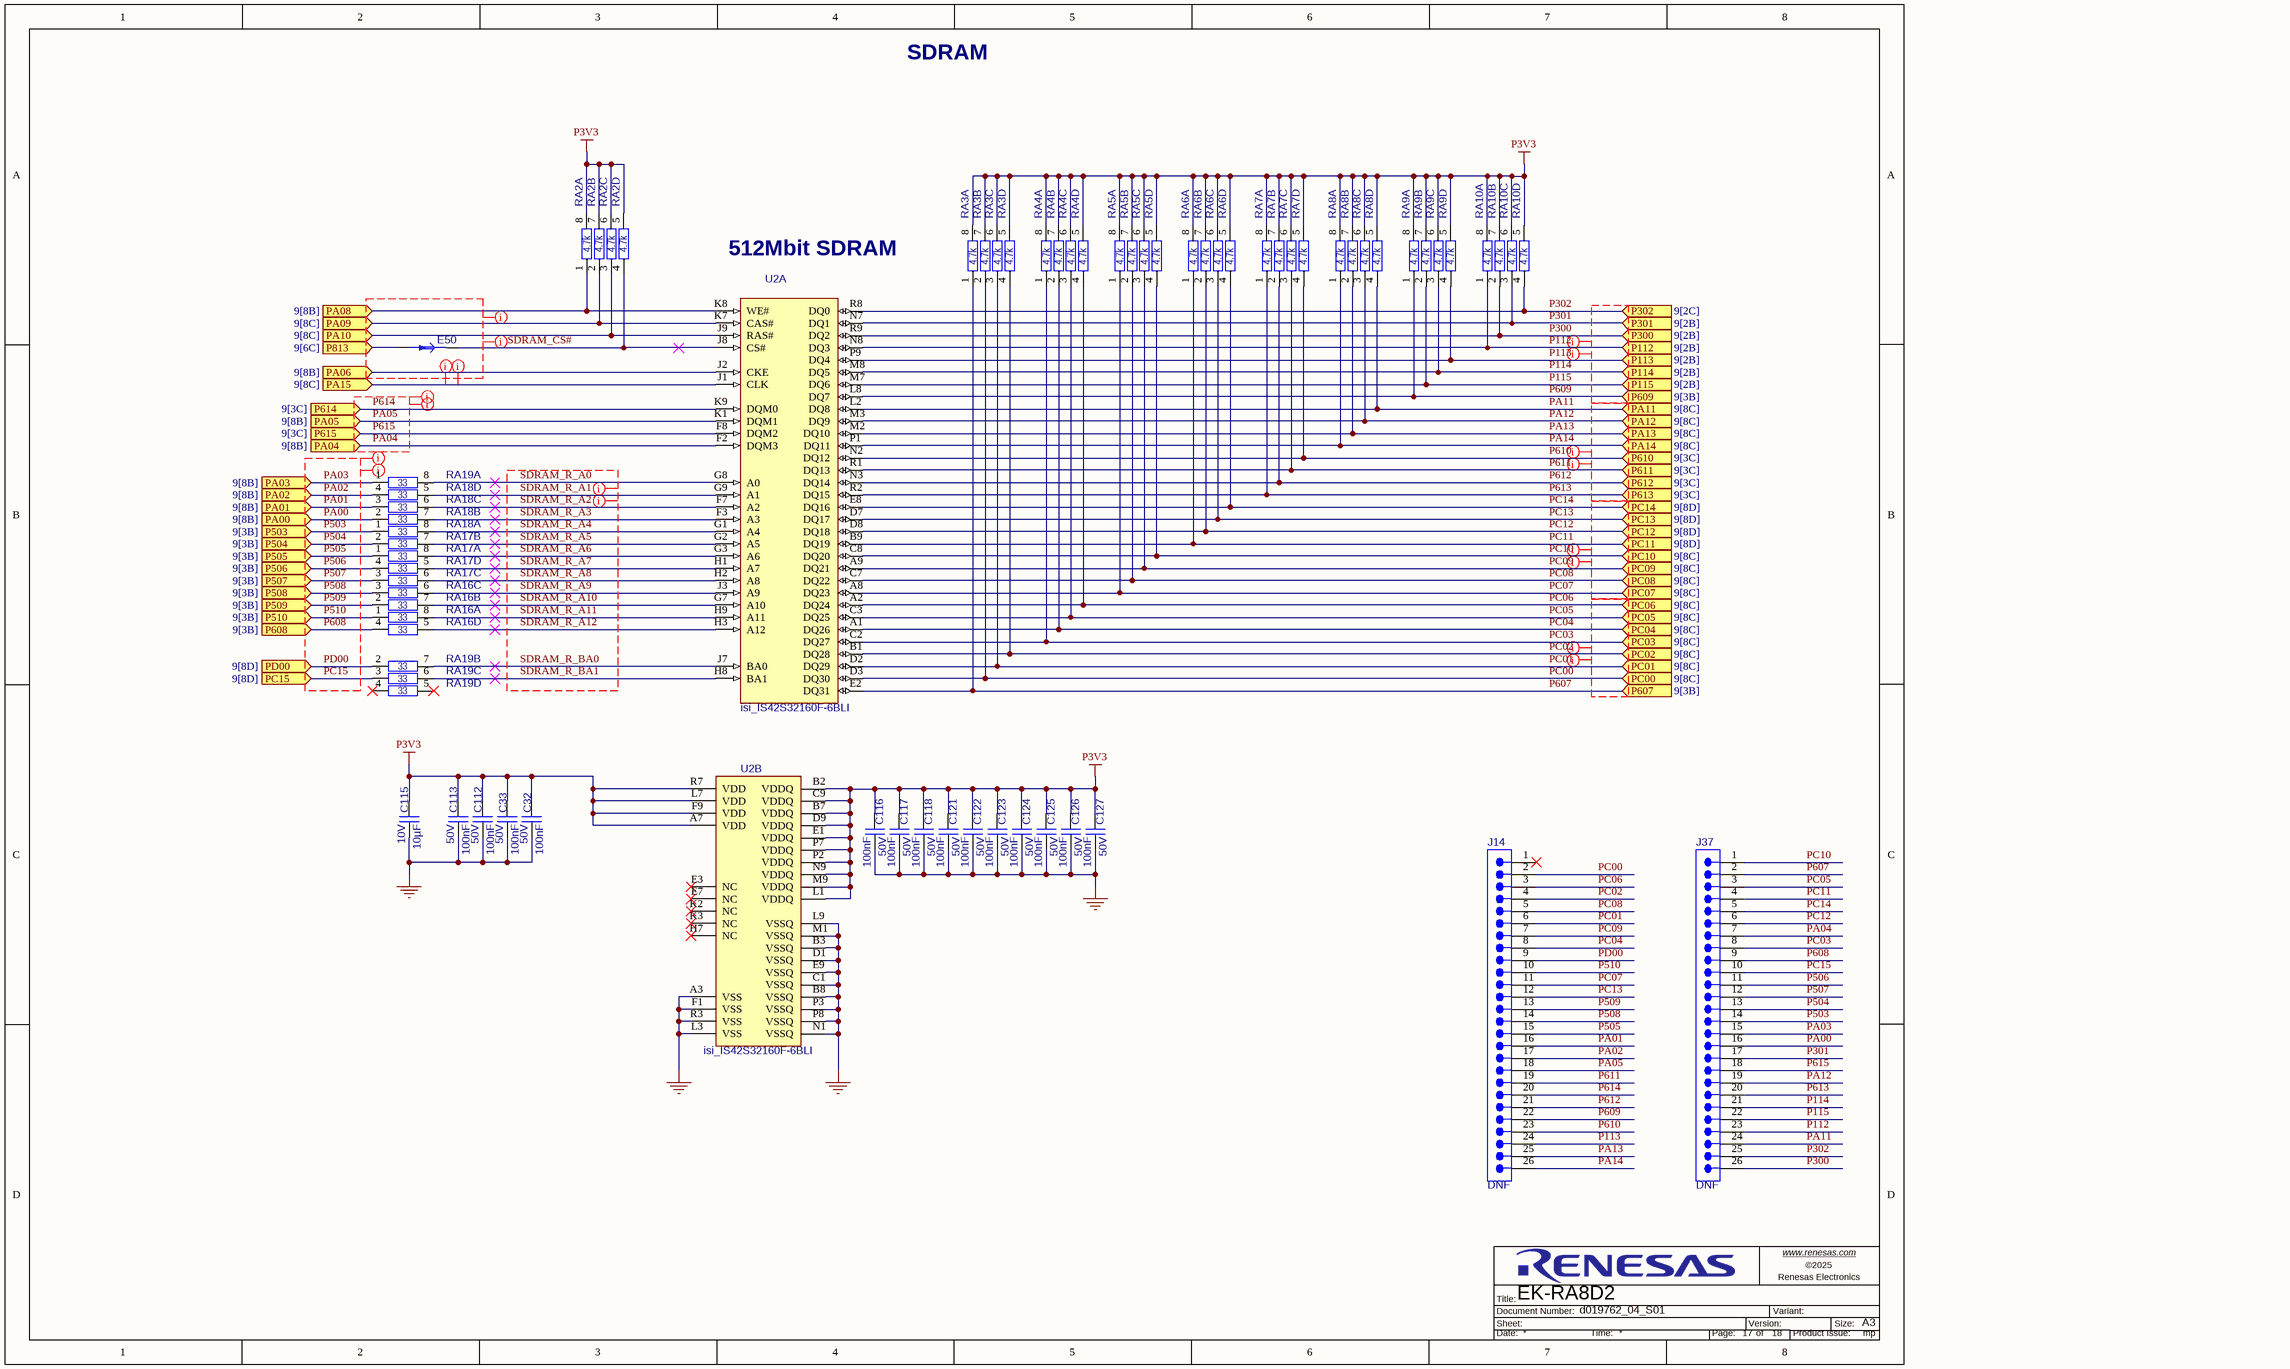
[diagram p16: SDRAM.SchDoc]

### Parts
C32  value 100nF  Operating Voltage Max: 50V  [C_EIA0402_0p55]  (hidden comment: Capacitor)
C33  value 100nF  Operating Voltage Max: 50V  [C_EIA0402_0p55]  (hidden comment: Capacitor)
C112  value 100nF  Operating Voltage Max: 50V  [C_EIA0402_0p55]  (hidden comment: Capacitor)
C113  value 100nF  Operating Voltage Max: 50V  [C_EIA0402_0p55]  (hidden comment: Capacitor)
C115  value 10µF  Operating Voltage Max: 10V  [C_EIA0402_0p7]  (hidden comment: Capacitor)
C116  value 100nF  Operating Voltage Max: 50V  [C_EIA0402_0p55]  (hidden comment: Capacitor)
C117  value 100nF  Operating Voltage Max: 50V  [C_EIA0402_0p55]  (hidden comment: Capacitor)
C118  value 100nF  Operating Voltage Max: 50V  [C_EIA0402_0p55]  (hidden comment: Capacitor)
C121  value 100nF  Operating Voltage Max: 50V  [C_EIA0402_0p55]  (hidden comment: Capacitor)
C122  value 100nF  Operating Voltage Max: 50V  [C_EIA0402_0p55]  (hidden comment: Capacitor)
C123  value 100nF  Operating Voltage Max: 50V  [C_EIA0402_0p55]  (hidden comment: Capacitor)
C124  value 100nF  Operating Voltage Max: 50V  [C_EIA0402_0p55]  (hidden comment: Capacitor)
C125  value 100nF  Operating Voltage Max: 50V  [C_EIA0402_0p55]  (hidden comment: Capacitor)
C126  value 100nF  Operating Voltage Max: 50V  [C_EIA0402_0p55]  (hidden comment: Capacitor)
C127  value 100nF  Operating Voltage Max: 50V  [C_EIA0402_0p55]  (hidden comment: Capacitor)
E50  TRACE_CUT_0805  [trace_cut_0805]  (value not drawn)  (net tie, no BOM)
J14  NRPN132PAEN-RC  [sul_NRPN132PAEN-RC]  (value not drawn)
J37  NRPN132PAEN-RC  [sul_NRPN132PAEN-RC]  (value not drawn)
RA2  value 4.7k  [R_Array_EIA0804]  (hidden comment: YC124-FR-074K7L)  (parts A,B,C,D of 4)
RA3  value 4.7k  [R_Array_EIA0804]  (hidden comment: Resistor_Array)  (parts A,B,C,D of 4)
RA4  value 4.7k  [R_Array_EIA0804]  (hidden comment: Resistor_Array)  (parts A,B,C,D of 4)
RA5  value 4.7k  [R_Array_EIA0804]  (hidden comment: Resistor_Array)  (parts A,B,C,D of 4)
RA6  value 4.7k  [R_Array_EIA0804]  (hidden comment: Resistor_Array)  (parts A,B,C,D of 4)
RA7  value 4.7k  [R_Array_EIA0804]  (hidden comment: Resistor_Array)  (parts A,B,C,D of 4)
RA8  value 4.7k  [R_Array_EIA0804]  (hidden comment: Resistor_Array)  (parts A,B,C,D of 4)
RA9  value 4.7k  [R_Array_EIA0804]  (hidden comment: Resistor_Array)  (parts A,B,C,D of 4)
RA10  value 4.7k  [R_Array_EIA0804]  (hidden comment: Resistor_Array)  (parts A,B,C,D of 4)
RA16  value 33  [R_Array_EIA0804]  (hidden comment: Resistor_Array)  (parts A,B,C,D of 4)
RA17  value 33  [R_Array_EIA0804]  (hidden comment: Resistor_Array)  (parts A,B,C,D of 4)
RA18  value 33  [R_Array_EIA0804]  (hidden comment: Resistor_Array)  (parts A,B,C,D of 4)
RA19  value 33  [R_Array_EIA0804]  (hidden comment: Resistor_Array)  (parts A,B,C,D of 4)
U2  isi_IS42S32160F-6BLI  [isi_TF-BGA-90_8x13mm]  (parts A,B of 2)

### Ports
P112 (in, see 9[2B]), P113 (in, see 9[2B]), P114 (in, see 9[2B]), P115 (in, see 9[2B]), P300 (in, see 9[2B]), P301 (in, see 9[2B]), P302 (in, see 9[2C]), P503 (in, see 9[3B]), P504 (in, see 9[3B]), P505 (in, see 9[3B]), P506 (in, see 9[3B]), P507 (in, see 9[3B]), P508 (in, see 9[3B]), P509 (in, see 9[3B]), P510 (in, see 9[3B]), P607 (in, see 9[3B]), P608 (in, see 9[3B]), P609 (in, see 9[3B]), P610 (in, see 9[3C]), P611 (in, see 9[3C]), P612 (in, see 9[3C]), P613 (in, see 9[3C]), P614 (in, see 9[3C]), P615 (in, see 9[3C]), P813 (in, see 9[6C]), PA00 (in, see 9[8B]), PA01 (in, see 9[8B]), PA02 (in, see 9[8B]), PA03 (in, see 9[8B]), PA04 (in, see 9[8B]), PA05 (in, see 9[8B]), PA06 (in, see 9[8B]), PA08 (in, see 9[8B]), PA09 (in, see 9[8C]), PA10 (in, see 9[8C]), PA11 (in, see 9[8C]), PA12 (in, see 9[8C]), PA13 (in, see 9[8C]), PA14 (in, see 9[8C]), PA15 (in, see 9[8C]), PC00 (in, see 9[8C]), PC01 (in, see 9[8C]), PC02 (in, see 9[8C]), PC03 (in, see 9[8C]), PC04 (in, see 9[8C]), PC05 (in, see 9[8C]), PC06 (in, see 9[8C]), PC07 (in, see 9[8C]), PC08 (in, see 9[8C]), PC09 (in, see 9[8C]), PC10 (in, see 9[8C]), PC11 (in, see 9[8D]), PC12 (in, see 9[8D]), PC13 (in, see 9[8D]), PC14 (in, see 9[8D]), PC15 (in, see 9[8D]), PD00 (in, see 9[8D])

### Nets
GND: C32.2 C33.2 C112.2 C113.2 C115.2 C116.2 C117.2 C118.2 C121.2 C122.2 C123.2 C124.2 C125.2 C126.2 C127.2 U2.A3(VSS) U2.B3(VSSQ) U2.B8(VSSQ) U2.C1(VSSQ) U2.D1(VSSQ) U2.E9(VSSQ) U2.F1(VSS) U2.L3(VSS) U2.L9(VSSQ) U2.M1(VSSQ) U2.N1(VSSQ) U2.P3(VSSQ) U2.P8(VSSQ) U2.R3(VSS)
P3V3: C32.1 C33.1 C112.1 C113.1 C115.1 C116.1 C117.1 C118.1 C121.1 C122.1 C123.1 C124.1 C125.1 C126.1 C127.1 RA2.5 RA2.6 RA2.7 RA2.8 RA3.5 RA3.6 RA3.7 RA3.8 RA4.5 RA4.6 RA4.7 RA4.8 RA5.5 RA5.6 RA5.7 RA5.8 RA6.5 RA6.6 RA6.7 RA6.8 RA7.5 RA7.6 RA7.7 RA7.8 RA8.5 RA8.6 RA8.7 RA8.8 RA9.5 RA9.6 RA9.7 RA9.8 RA10.5 RA10.6 RA10.7 RA10.8 U2.A7(VDD) U2.B2(VDDQ) U2.B7(VDDQ) U2.C9(VDDQ) U2.D9(VDDQ) U2.E1(VDDQ) U2.F9(VDD) U2.L1(VDDQ) U2.L7(VDD) U2.M9(VDDQ) U2.N9(VDDQ) U2.P2(VDDQ) U2.P7(VDDQ) U2.R7(VDD)
P112: J37.23 RA10.1 U2.N8(DQ3) ; port P112
P113: J14.24 RA9.4 U2.P9(DQ4) ; port P113
P114: J37.21 RA9.3 U2.M8(DQ5) ; port P114
P115: J37.22 RA9.2 U2.M7(DQ6) ; port P115
P300: J37.26 RA10.2 U2.R9(DQ2) ; port P300
P301: J37.17 RA10.3 U2.N7(DQ1) ; port P301
P302: J37.25 RA10.4 U2.R8(DQ0) ; port P302
P503: J37.14 RA18.1 ; port P503
P504: J37.13 RA17.2 ; port P504
P505: J14.15 RA17.1 ; port P505
P506: J37.11 RA17.4 ; port P506
P507: J37.12 RA17.3 ; port P507
P508: J14.14 RA16.3 ; port P508
P509: J14.13 RA16.2 ; port P509
P510: J14.10 RA16.1 ; port P510
P607: J37.2 RA3.1 U2.E2(DQ31) ; port P607
P608: J37.9 RA16.4 ; port P608
P609: J14.22 RA9.1 U2.L8(DQ7) ; port P609
P610: J14.23 RA7.4 U2.N2(DQ12) ; port P610
P611: J14.19 RA7.3 U2.R1(DQ13) ; port P611
P612: J14.21 RA7.2 U2.N3(DQ14) ; port P612
P613: J37.20 RA7.1 U2.R2(DQ15) ; port P613
P614: J14.20 U2.K9(DQM0) ; port P614
P615: J37.18 U2.F8(DQM2) ; port P615
P813: E50.2 ; port P813
PA00: J37.16 RA18.2 ; port PA00
PA01: J14.16 RA18.3 ; port PA01
PA02: J14.17 RA18.4 ; port PA02
PA03: J37.15 RA19.1 ; port PA03
PA04: J37.7 U2.F2(DQM3) ; port PA04
PA05: J14.18 U2.K1(DQM1) ; port PA05
PA06: U2.J2(CKE) ; port PA06
PA08: RA2.1 U2.K8(WE#) ; port PA08
PA09: RA2.2 U2.K7(CAS#) ; port PA09
PA10: RA2.3 U2.J9(RAS#) ; port PA10
PA11: J37.24 RA8.4 U2.L2(DQ8) ; port PA11
PA12: J37.19 RA8.3 U2.M3(DQ9) ; port PA12
PA13: J14.25 RA8.2 U2.M2(DQ10) ; port PA13
PA14: J14.26 RA8.1 U2.P1(DQ11) ; port PA14
PA15: U2.J1(CLK) ; port PA15
PC00: J14.2 RA3.2 U2.D3(DQ30) ; port PC00
PC01: J14.6 RA3.3 U2.D2(DQ29) ; port PC01
PC02: J14.4 RA3.4 U2.B1(DQ28) ; port PC02
PC03: J37.8 RA4.1 U2.C2(DQ27) ; port PC03
PC04: J14.8 RA4.2 U2.A1(DQ26) ; port PC04
PC05: J37.3 RA4.3 U2.C3(DQ25) ; port PC05
PC06: J14.3 RA4.4 U2.A2(DQ24) ; port PC06
PC07: J14.11 RA5.1 U2.A8(DQ23) ; port PC07
PC08: J14.5 RA5.2 U2.C7(DQ22) ; port PC08
PC09: J14.7 RA5.3 U2.A9(DQ21) ; port PC09
PC10: J37.1 RA5.4 U2.C8(DQ20) ; port PC10
PC11: J37.4 RA6.1 U2.B9(DQ19) ; port PC11
PC12: J37.6 RA6.2 U2.D8(DQ18) ; port PC12
PC13: J14.12 RA6.3 U2.D7(DQ17) ; port PC13
PC14: J37.5 RA6.4 U2.E8(DQ16) ; port PC14
PC15: J37.10 RA19.3 ; port PC15
PD00: J14.9 RA19.2 ; port PD00
SDRAM_CS#: E50.1 RA2.4 U2.J8(CS#)
SDRAM_R_A0: RA19.8 U2.G8(A0)
SDRAM_R_A1: RA18.5 U2.G9(A1)
SDRAM_R_A2: RA18.6 U2.F7(A2)
SDRAM_R_A3: RA18.7 U2.F3(A3)
SDRAM_R_A4: RA18.8 U2.G1(A4)
SDRAM_R_A5: RA17.7 U2.G2(A5)
SDRAM_R_A6: RA17.8 U2.G3(A6)
SDRAM_R_A7: RA17.5 U2.H1(A7)
SDRAM_R_A8: RA17.6 U2.H2(A8)
SDRAM_R_A9: RA16.6 U2.J3(A9)
SDRAM_R_A10: RA16.7 U2.G7(A10)
SDRAM_R_A11: RA16.8 U2.H9(A11)
SDRAM_R_A12: RA16.5 U2.H3(A12)
SDRAM_R_BA0: RA19.7 U2.J7(BA0)
SDRAM_R_BA1: RA19.6 U2.H8(BA1)

Not connected (* = marked no-connect by the designer): J14 1*; RA19 4* 5*; U2 E3(NC)* E7(NC)* H7(NC)* K2(NC)* K3(NC)*

### Layout directives
net class SDRAM_CONTROL: (no net found under the mark)
net class SDRAM_CLOCK: PA15
net class SDRAM_ADDRESS: P503, P504, P505, P506, P507, P508, P509, P510, P608, PA00, PA01, PA02, PA03, PC15, PD00, SDRAM_R_A0, SDRAM_R_A1, SDRAM_R_A2, SDRAM_R_A3, SDRAM_R_A4, SDRAM_R_A5, SDRAM_R_A6, SDRAM_R_A7, SDRAM_R_A8, SDRAM_R_A9, SDRAM_R_A10, SDRAM_R_A11, SDRAM_R_A12, SDRAM_R_BA0, SDRAM_R_BA1
net class SDRAM_DQM: P614, P615, PA04, PA05
net class SDRAM: (no net found under the mark), P503, P504, P505, P506, P507, P508, P509, P510, P608, P614, P615, PA00, PA01, PA02, PA03, PA04, PA05, PA15, PC15, PD00, SDRAM_R_A0, SDRAM_R_A1, SDRAM_R_A2, SDRAM_R_A3, SDRAM_R_A4, SDRAM_R_A5, SDRAM_R_A6, SDRAM_R_A7, SDRAM_R_A8, SDRAM_R_A9, SDRAM_R_A10, SDRAM_R_A11, SDRAM_R_A12, SDRAM_R_BA0, SDRAM_R_BA1
net class SDRAM_DATA_0: (no net found under the mark)
net class SDRAM_DATA_1: (no net found under the mark)
net class SDRAM_DATA_2: (no net found under the mark)
net class SDRAM_DATA_3: (no net found under the mark)

### Notes on the sheet
- SDRAM
- 512Mbit SDRAM
- www.renesas.com <http://www.renesas.com>
- Sheet:
- Title:
- Document Number:
- Version:
- Variant:
- Renesas Electronics
- Size:
- A3
- Date:
- Time:
- Page:
- of
- Product Issue:

### Library data of the parts
C32 C33 C112 C113 C116-C118 C121-C127 = CAP-00003203-9: Capacitor,EIA0402,100n,50V,X7R; Tolerance: 10%; Qualification: AEC-Q200; Subtype: MLCC; Dielectric: X7R; Height: 550µm; Operating Temperature Max: 125°C; Operating Temperature Min: -55°C
C115 = CAP-00003447-8: Capacitor,EIA0402,10u,10V,X5R; Tolerance: 20%; Subtype: MLCC; Dielectric: X5R; Height: 700µm; Operating Temperature Max: 85°C; Operating Temperature Min: -55°C; Qualification: -
E50 = MIS-00000000-11: Trace Cut, SMD, 0805 size; Value: TC; Pin Count: 2; Qualification: -; Subtype: Trace Cut
J14 J37 = CON-00000094-5: Header,26way,2row,vertical,2.00mm,THT; Operating Voltage Max: 150V; DC Resistance: 20m; Gender: male; Current: 2A; Pin Count: 26; Operating Temperature Max: 105°C; Operating Temperature Min: -40°C; Qualification: -; Height: 8.8mm; DNF: DNF
RA2-RA10 = RES-00003456-16: Resistor Network & Array,0804,4.7k,0.0625W; Power: 62.5mW; Tolerance: 1%; Qualification: AEC-Q200; Subtype: Resistor Array; Temperature Coefficient: 200ppm; Operating Temperature Max: 155°C; Operating Temperature Min: -55°C
RA16-RA19 = RES-00003457-16: Resistor Network & Array,0804,33,0.0625W; Power: 62.5mW; Tolerance: 1%; Qualification: AEC-Q200; Subtype: Resistor Array; Temperature Coefficient: 200ppm; Operating Temperature Max: 155°C; Operating Temperature Min: -55°C
U2 = ICS-00000024-8: 512Mb Synchronous DRAM, 16MX32, 5.4ns, CMOS, TF-BGA90; Operating Voltage Max: 3.6V; Operating Voltage Min: 2.3V; Subtype: Digital; Operating Temperature Max: 85°C; Operating Temperature Min: -40°C; Pin Count: 90; Qualification: -

## Sheet Audio Devices.SchDoc
size A3; Company Name: Renesas Electronics America; CompanyURL: www.renesas.com; PageSetup: Record=PageOptions|CenterHorizontal=True|CenterVertical=True|PrintScale=1.00|XCorrection=1.00|YCorrection=1.00|PrintKind=1|BorderSize=5000000|LeftOffset=0|BottomOffset=0|Orientation=2|PaperLength=1000|PaperWidth=1000|Scale=100|PaperSource=7|PrintQuality=-4|MediaType=1|DitherType=10|PaperKind=A5 148x210mm|PrintScaleMode=1; ReleaseDate: 16.09.2025; Version: MP; SheetNumber: 18; SheetTotal: 18; VariantNumber: 0; DSheetNumber: 1
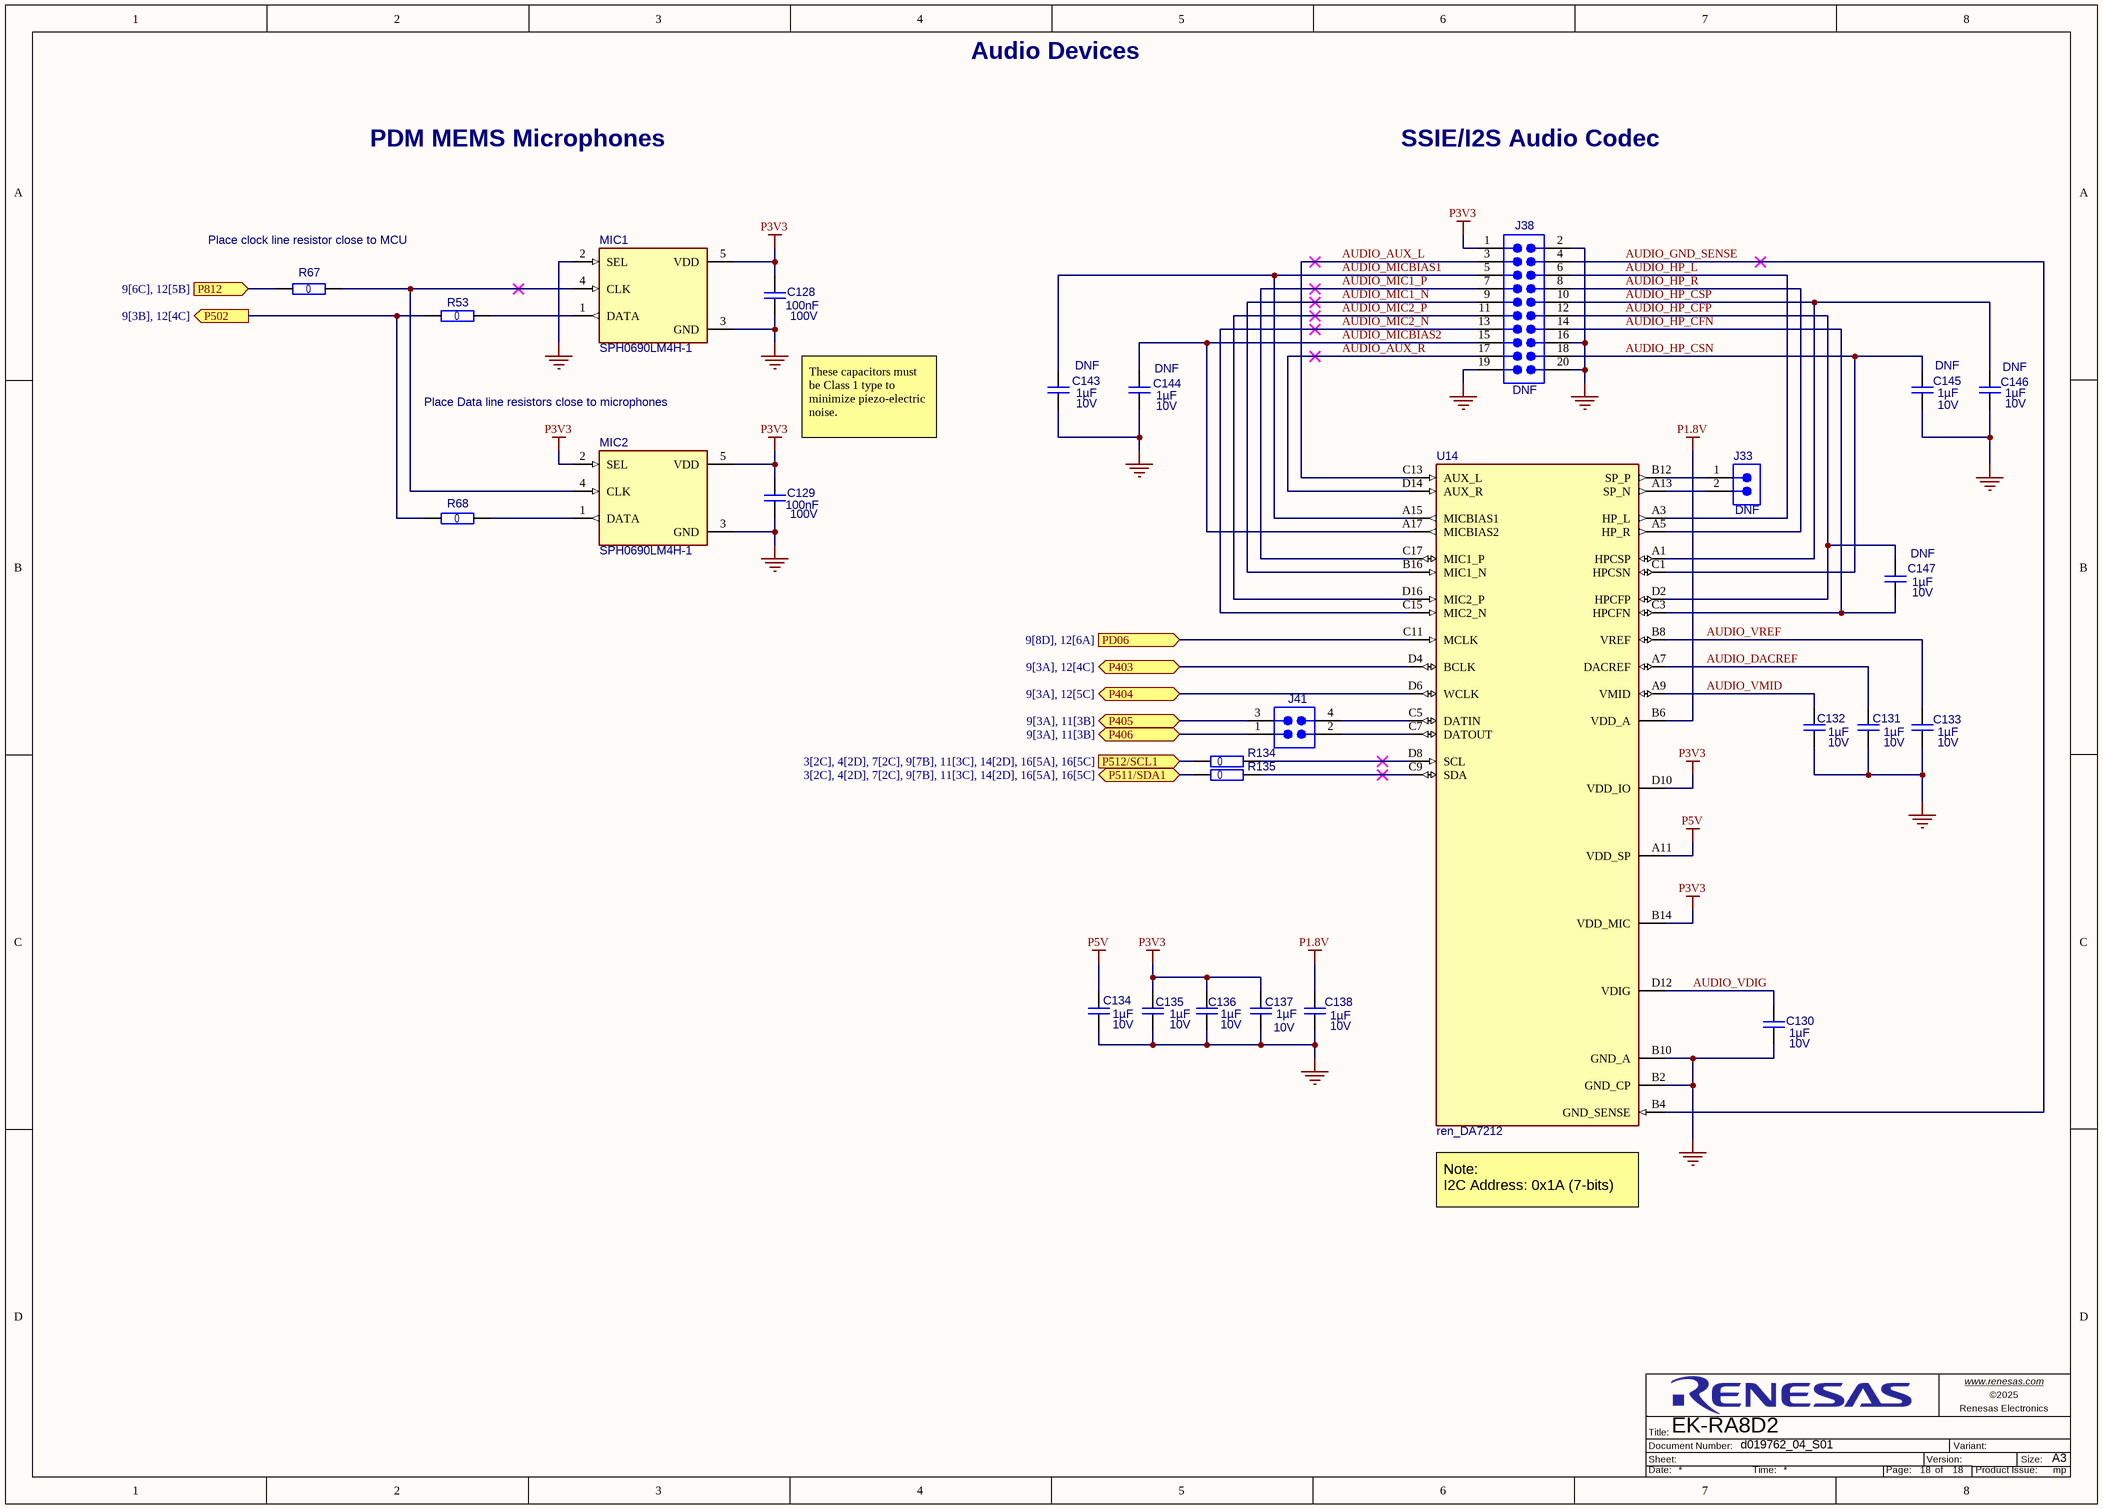
[diagram p17: Audio Devices.SchDoc]

### Parts
C128  value 100nF  Operating Voltage Max: 100V  [C_EIA1206_1p8]  (hidden comment: Capacitor)
C129  value 100nF  Operating Voltage Max: 100V  [C_EIA1206_1p8]  (hidden comment: Capacitor)
C130  value 1µF  Operating Voltage Max: 10V  [C_EIA0201_0p4]  (hidden comment: Capacitor)
C131  value 1µF  Operating Voltage Max: 10V  [C_EIA0201_0p4]  (hidden comment: Capacitor)
C132  value 1µF  Operating Voltage Max: 10V  [C_EIA0201_0p4]  (hidden comment: Capacitor)
C133  value 1µF  Operating Voltage Max: 10V  [C_EIA0201_0p4]  (hidden comment: Capacitor)
C134  value 1µF  Operating Voltage Max: 10V  [C_EIA0201_0p4]  (hidden comment: Capacitor)
C135  value 1µF  Operating Voltage Max: 10V  [C_EIA0201_0p4]  (hidden comment: Capacitor)
C136  value 1µF  Operating Voltage Max: 10V  [C_EIA0201_0p4]  (hidden comment: Capacitor)
C137  value 1µF  Operating Voltage Max: 10V  [C_EIA0201_0p4]  (hidden comment: Capacitor)
C138  value 1µF  Operating Voltage Max: 10V  [C_EIA0201_0p4]  (hidden comment: Capacitor)
C143  value 1µF  Operating Voltage Max: 10V  [C_EIA0201_0p4]  (hidden comment: Capacitor)
C144  value 1µF  Operating Voltage Max: 10V  [C_EIA0201_0p4]  (hidden comment: Capacitor)
C145  value 1µF  Operating Voltage Max: 10V  [C_EIA0201_0p4]  (hidden comment: Capacitor)
C146  value 1µF  Operating Voltage Max: 10V  [C_EIA0201_0p4]  (hidden comment: Capacitor)
C147  value 1µF  Operating Voltage Max: 10V  [C_EIA0201_0p4]  (hidden comment: Capacitor)
J33  CON_002  [wue_61300211121]  (value not drawn)
J38  62002021121  [wue_62002021121]  (value not drawn)
J41  57202-G52-02ALF  [amp_57202-G52-02ALF]  (value not drawn)
MIC1  SPH0690LM4H-1  [knw_LGA_3.5x2.65]
MIC2  SPH0690LM4H-1  [knw_LGA_3.5x2.65]
R53  value 0  [R_EIA0402]  (hidden comment: Resistor)
R67  value 0  [R_EIA0402]  (hidden comment: Resistor)
R68  value 0  [R_EIA0402]  (hidden comment: Resistor)
R134  value 0  [R_EIA0402]  (hidden comment: Resistor)
R135  value 0  [R_EIA0402]  (hidden comment: Resistor)
U14  ren_DA7212  [ren_34-ball-WL-CSP]

### Ports
P403 (bidir, see 9[3A], 12[4C]), P404 (bidir, see 9[3A], 12[5C]), P405 (bidir, see 9[3A], 11[3B]), P406 (bidir, see 9[3A], 11[3B]), P502 (out, see 9[3B], 12[4C]), P511/SDA1 (bidir, see 3[2C], 4[2D], 7[2C], 9[7B], 11[3C], 14[2D], 16[5A], 16[5C]), P512/SCL1 (in, see 3[2C], 4[2D], 7[2C], 9[7B], 11[3C], 14[2D], 16[5A], 16[5C]), P812 (in, see 9[6C], 12[5B]), PD06 (in, see 9[8D], 12[6A])

### Nets
GND: C128.2 C129.2 C130.2 C131.2 C132.2 C133.2 C134.2 C135.2 C136.2 C137.2 C138.2 C143.2 C144.2 C145.2 C146.2 J38.2 J38.16 J38.19 J38.20 MIC1.2(SEL) MIC1.3(GND) MIC2.3(GND) U14.B2(GND_CP) U14.B10(GND_A)
P1.8V: C138.1 U14.B6(VDD_A)
P3V3: C128.1 C129.1 C135.1 C136.1 C137.1 J38.1 MIC1.5(VDD) MIC2.2(SEL) MIC2.5(VDD) U14.B14(VDD_MIC) U14.D10(VDD_IO)
P5V: C134.1 U14.A11(VDD_SP)
AUDIO_AUX_L: J38.3 U14.C13(AUX_L)
AUDIO_AUX_R: J38.17 U14.D14(AUX_R)
AUDIO_DACREF: C131.1 U14.A7(DACREF)
AUDIO_GND_SENSE: J38.4 U14.B4(GND_SENSE)
AUDIO_HP_CFN: C147.2 J38.14 U14.C3(HPCFN)
AUDIO_HP_CFP: C147.1 J38.12 U14.D2(HPCFP)
AUDIO_HP_CSN: C145.1 J38.18 U14.C1(HPCSN)
AUDIO_HP_CSP: C146.1 J38.10 U14.A1(HPCSP)
AUDIO_HP_L: J38.6 U14.A3(HP_L)
AUDIO_HP_R: J38.8 U14.A5(HP_R)
AUDIO_MIC1_N: J38.9 U14.B16(MIC1_N)
AUDIO_MIC1_P: J38.7 U14.C17(MIC1_P)
AUDIO_MIC2_N: J38.13 U14.C15(MIC2_N)
AUDIO_MIC2_P: J38.11 U14.D16(MIC2_P)
AUDIO_MICBIAS1: C143.1 J38.5 U14.A15(MICBIAS1)
AUDIO_MICBIAS2: C144.1 J38.15 U14.A17(MICBIAS2)
AUDIO_VDIG: C130.1 U14.D12(VDIG)
AUDIO_VMID: C132.1 U14.A9(VMID)
AUDIO_VREF: C133.1 U14.B8(VREF)
P403: U14.D4(BCLK) ; port P403
P404: U14.D6(WCLK) ; port P404
P405: J41.3 ; port P405
P406: J41.1 ; port P406
P502: R53.1 R68.1 ; port P502
P511/SDA1: R135.2 ; port P511/SDA1
P512/SCL1: R134.2 ; port P512/SCL1
P812: R67.1 ; port P812
PD06: U14.C11(MCLK) ; port PD06
NetJ33_1: J33.1 U14.B12(SP_P)
NetJ33_2: J33.2 U14.A13(SP_N)
NetJ41_2: J41.2 U14.C7(DATOUT)
NetJ41_4: J41.4 U14.C5(DATIN)
NetMIC1_1: MIC1.1(DATA) R53.2
NetMIC1_4: MIC1.4(CLK) MIC2.4(CLK) R67.2
NetMIC2_1: MIC2.1(DATA) R68.2
NetR134_1: R134.1 U14.D8(SCL)
NetR135_1: R135.1 U14.C9(SDA)

### Notes on the sheet
- Audio Devices
- PDM MEMS Microphones
- SSIE/I2S Audio Codec
- (near R67) Place clock line resistor close to MCU
- Place Data line resistors close to microphones
- These capacitors must be Class 1 type to minimize piezo-electric noise.
- (near U14) Note:
  I2C Address: 0x1A (7-bits)
- www.renesas.com <http://www.renesas.com>
- Sheet:
- Title:
- Document Number:
- Version:
- Variant:
- Renesas Electronics
- Size:
- A3
- Date:
- Time:
- Page:
- of
- Product Issue:

### Library data of the parts
C128 C129 = CAP-00000010-3: Capacitor,EIA1206,100n,100V,C0G; Tolerance: 5%; Qualification: AEC-Q200; Subtype: MLCC; Dielectric: C0G; Height: 1.8mm; Operating Temperature Max: 125°C; Operating Temperature Min: -55°C
C130-C138 C143-C147 = CAP-00000011-4: Capacitor,EA0201,1u,10V,X6S; Tolerance: 20%; Qualification: AEC-Q200; Subtype: MLCC; Dielectric: X6S; Height: 390µm; Operating Temperature Max: 105°C; Operating Temperature Min: -55°C
  C143-C147: DNF: DNF
J33 = CON-00003283-14: Header,2way,1row,vertical,2.54mm,THT; Current: 3A; DC Resistance: 20m; Gender: male; Operating Voltage Max: 250V; Height: 8.89mm; Operating Temperature Max: 105°C; Operating Temperature Min: -40°C; Pin Count: 2; Qualification: -; DNF: DNF
J38 = CON-00000115-3: Header,20way,2row,vertical,2.00mm,THT; DC Resistance: 20m; Operating Voltage Max: 200V; Gender: male; Current: 2A; Operating Temperature Min: -40°C; Pin Count: 20; Height: 6.45mm; Operating Temperature Max: 105°C; Qualification: -; DNF: DNF
J41 = CON-00000063-4: Header,4way,2row,vertical,2mm,SMD; Current: 2A; Operating Voltage Max: 200V; Gender: male; DC Resistance: 20m; Operating Temperature Min: -55°C; Pin Count: 4; Height: 6.83mm; Qualification: -; Operating Temperature Max: 125°C
MIC1 MIC2 = ICS-00000023-7: Multimode Digital Bottom Port Silicon Digital Microphone with a single bit PDM output; Operating Voltage Max: 3.6V; Operating Voltage Min: 1.65V; Subtype: Sensor; Operating Temperature Max: 100°C; Operating Temperature Min: -40°C; Pin Count: 5; Qualification: -
R53 R67 R68 R134 R135 = RES-00000801-9: Resistor,EIA0402,0,0.0625W; Power: 62.5mW; Tolerance: 5%; Subtype: Chip Resistor; Operating Temperature Max: 155°C; Operating Temperature Min: -55°C; Qualification: -
U14 = ICS-00000019-7: Ultra-Low Power Stereo Codec; Operating Voltage Max: 5.25V; Operating Voltage Min: 950mV; Subtype: Mixed; Operating Temperature Max: 85°C; Operating Temperature Min: -40°C; Pin Count: 34; Qualification: -